# EAGLE design EngineeringModelBoard(6:2015) (EAGLE 7.3.0)

## Sheet 1 of 7: µC and Programming
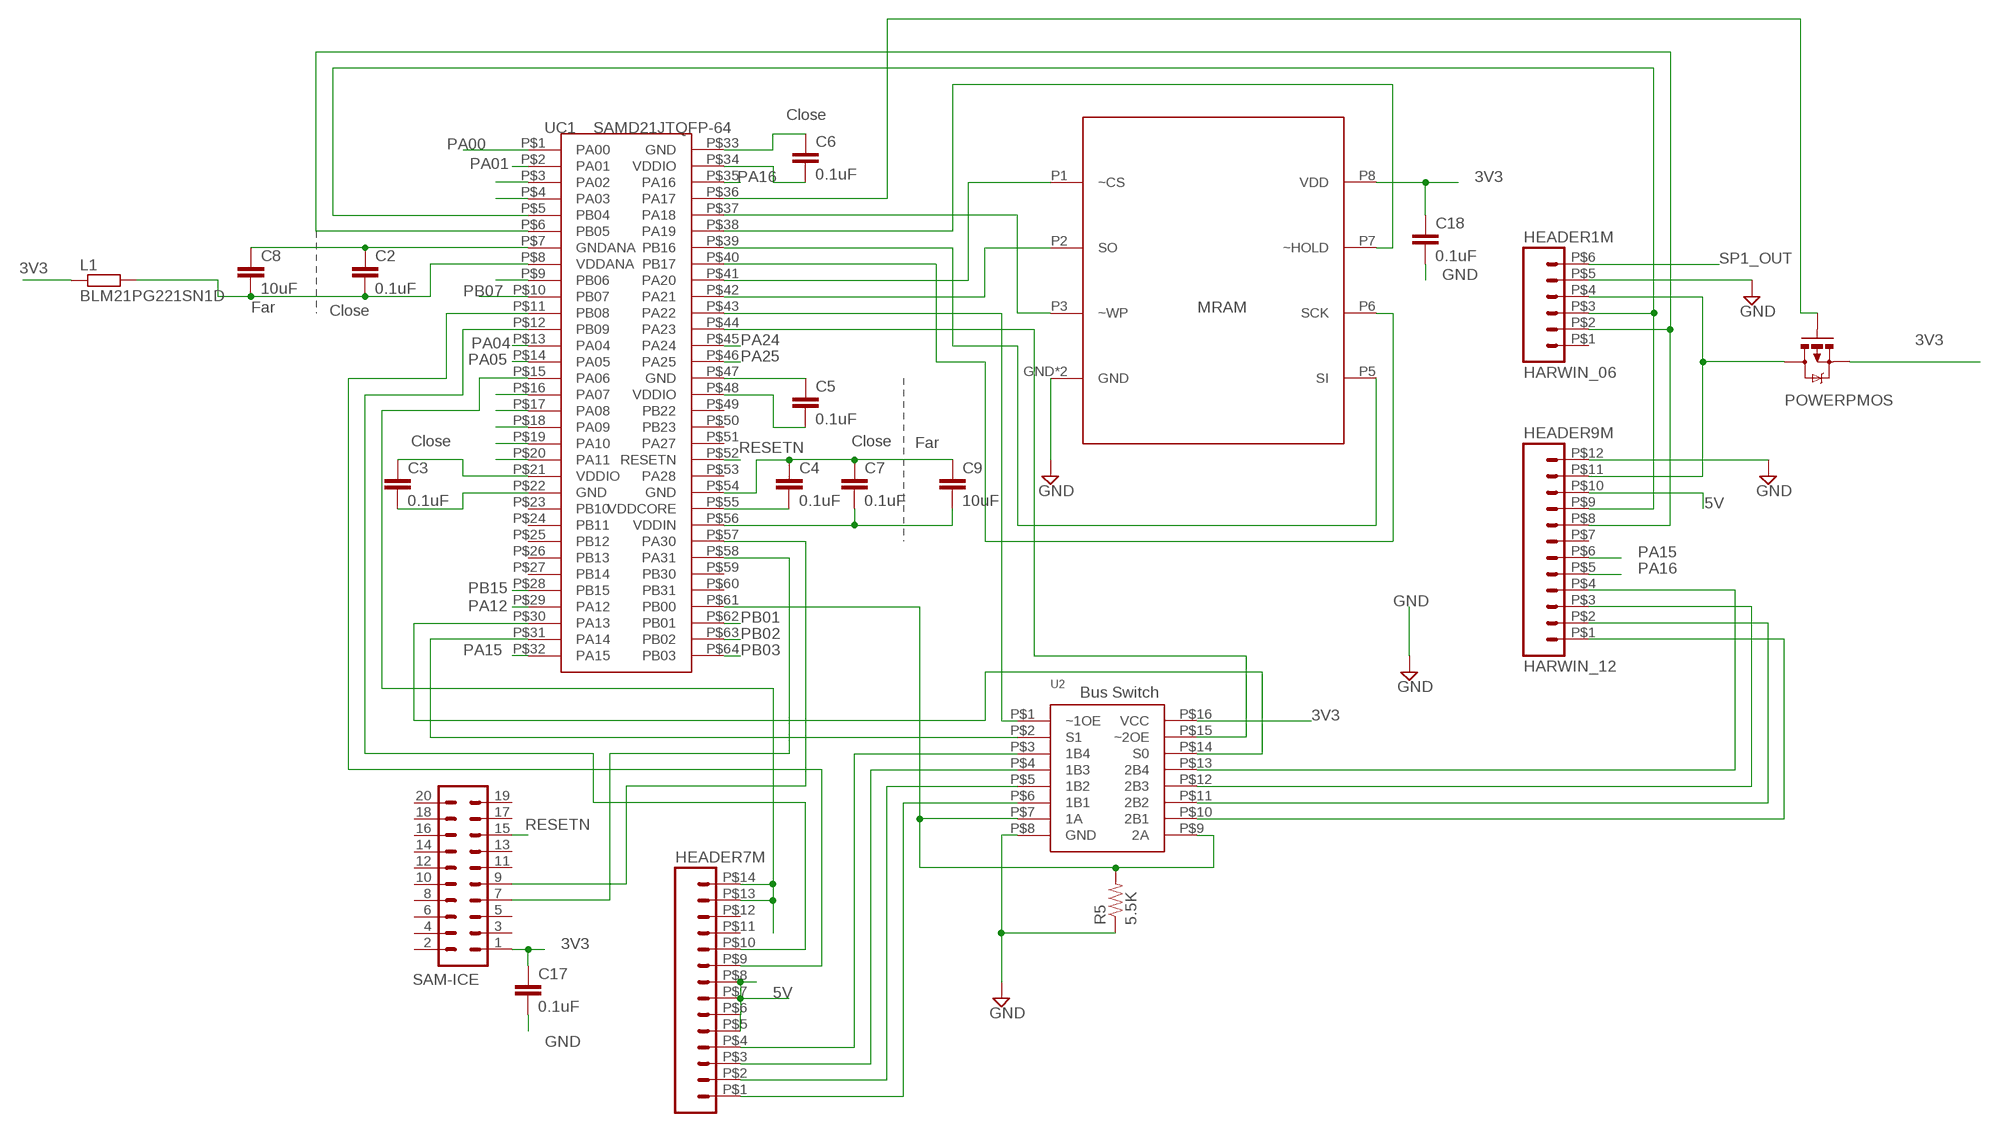
[diagram p0: schematic, sheet 1]

### Parts
C2  0.1uF  CAP0805  [0805]
C3  0.1uF  CAP0805  [0805]
C4  0.1uF  CAP0805  [0805]
C5  0.1uF  CAP0805  [0805]
C6  0.1uF  CAP0805  [0805]
C7  0.1uF  CAP0805  [0805]
C8  10uF  CAP0805  [0805]
C9  10uF  CAP0805  [0805]
C17  0.1uF  CAP0805  [0805]
C18  0.1uF  CAP0805  [0805]
HEADER1M  HARWIN_06  [HARWIN_DATAMATE_6]
HEADER7M  HARWIN_14  [HARWIN_DATAMATE_14]
HEADER9M  HARWIN_12  [HARWIN_DATAMATE_12]
L1  BLM21PG221SN1D  R-EU_R0805  [R0805]
R5  5.5K  RESISTOR  [0805]
SAM-ICE  IDC_JTAG_CONNECTOR  [2X10]
U2  SN74CBTLV3253  [SOIC16R]
U$3  MRAM  MR25H10CDC  [8PXMO-229]
U$14  POWERPMOS  [SO08]
UC1  SAMD21JTQFP-64  [TQFP-64]

### Nets
3V3 [3V3]: C3.1 C5.2 C6.2 C7.2 C9.2 C17.1 C18.1 L1.1 SAM-ICE.1 U2.P$16(VCC) U$3.P8(VDD) U$14.1(S) U$14.2(S) U$14.3(S) UC1.P$21(VDDIO) UC1.P$34(VDDIO) UC1.P$48(VDDIO) UC1.P$56(VDDIN) ; also sheet 4,5
3V3D [3V3]: HEADER1M.P$4 HEADER9M.P$11 U$14.5(D) U$14.6(D) U$14.7(D) U$14.8(D)
5V [5V]: HEADER7M.P$5 HEADER7M.P$6 HEADER7M.P$7 HEADER7M.P$8 HEADER9M.P$10 ; also sheet 4
GND [GND]: C2.1 C4.1 C5.1 C6.1 C7.1 C8.1 C9.1 C17.2 C18.2 HEADER1M.P$5 HEADER9M.P$12 R5.1 U2.P$8(GND) U$3.GND U$3.P4(GND) UC1.P$7(GNDANA) UC1.P$33(GND) UC1.P$47(GND) UC1.P$54(GND) ; also sheet 4,5,6
N$16: U$3.P1(~CS) UC1.P$41(PA20)
N$18: U$3.P2(SO) UC1.P$42(PA21)
N$19: U$3.P3(~WP) UC1.P$37(PA18)
N$20: HEADER9M.P$1 U2.P$10(2B1)
N$21: HEADER9M.P$2 U2.P$11(2B2)
N$22: HEADER9M.P$3 U2.P$12(2B3)
N$23: HEADER9M.P$4 U2.P$13(2B4)
N$24: HEADER7M.P$1 U2.P$6(1B1)
N$25: HEADER7M.P$2 U2.P$5(1B2)
N$26: HEADER7M.P$3 U2.P$4(1B3)
N$27: HEADER7M.P$4 U2.P$3(1B4)
N$28: U2.P$14(S0) UC1.P$30(PA13)
N$29: U2.P$2(S1) UC1.P$31(PA14)
N$30: U2.P$1(~1OE) UC1.P$43(PA22)
N$31: U2.P$15(~2OE) UC1.P$44(PA23)
N$34: U$3.P7(~HOLD) UC1.P$38(PA19)
N$35: U$3.P6(SCK) UC1.P$40(PB17)
N$38: SAM-ICE.7 UC1.P$58(PA31)
N$39: SAM-ICE.9 UC1.P$57(PA30)
N$41: C3.2 UC1.P$22(GND)
N$42: U$3.P5(SI) UC1.P$39(PB16)
N$43: C2.2 C8.2 L1.2 UC1.P$8(VDDANA)
N$47: C4.2 UC1.P$55(VDDCORE)
N$72: U$14.4(G) UC1.P$36(PA17)
PA00: UC1.P$1(PA00) ; also sheet 5
PA01: UC1.P$2(PA01) ; also sheet 5
PA02: UC1.P$3(PA02)
PA03: UC1.P$4(PA03)
PA04: UC1.P$13(PA04) ; also sheet 5
PA05: UC1.P$14(PA05) ; also sheet 5
PA06: HEADER7M.P$13 HEADER7M.P$14 UC1.P$15(PA06)
PA07: UC1.P$16(PA07)
PA08: UC1.P$17(PA08)
PA09: UC1.P$18(PA09)
PA10: UC1.P$19(PA10)
PA11: UC1.P$20(PA11)
PA12: UC1.P$29(PA12) ; also sheet 5
PA15: HEADER9M.P$6 UC1.P$32(PA15)
PA16: HEADER9M.P$5 UC1.P$35(PA16)
PA24: UC1.P$45(PA24) ; also sheet 6
PA25: UC1.P$46(PA25) ; also sheet 6
PB00: R5.2 U2.P$7(1A) U2.P$9(2A) UC1.P$61(PB00)
PB01: UC1.P$62(PB01) ; also sheet 6
PB02: UC1.P$63(PB02) ; also sheet 6
PB03: UC1.P$64(PB03) ; also sheet 6
PB04: HEADER1M.P$3 HEADER9M.P$9 UC1.P$5(PB04)
PB05: HEADER1M.P$2 HEADER9M.P$8 UC1.P$6(PB05)
PB06: UC1.P$9(PB06)
PB07: UC1.P$10(PB07) ; also sheet 4
PB08: HEADER7M.P$9 UC1.P$11(PB08)
PB09: HEADER7M.P$10 UC1.P$12(PB09)
PB15: UC1.P$28(PB15) ; also sheet 5
RESETN: SAM-ICE.15 UC1.P$52(RESETN)
SP1_OUT: HEADER1M.P$6
Unconnected: HEADER1M.P$1 HEADER7M.P$11 HEADER7M.P$12 HEADER9M.P$7 SAM-ICE.2 SAM-ICE.3 SAM-ICE.4 SAM-ICE.5 SAM-ICE.6 SAM-ICE.8 SAM-ICE.10 SAM-ICE.11 SAM-ICE.12 SAM-ICE.13 SAM-ICE.14 SAM-ICE.16 SAM-ICE.17 SAM-ICE.18 SAM-ICE.19 SAM-ICE.20 UC1.P$23(PB10) UC1.P$24(PB11) UC1.P$25(PB12) UC1.P$26(PB13) UC1.P$27(PB14) UC1.P$49(PB22) UC1.P$50(PB23) UC1.P$51(PA27) UC1.P$53(PA28) UC1.P$59(PB30) UC1.P$60(PB31)

### Notes on the sheet
- Close
- Far | Close | MRAM
- Close | Close | Far
- Bus Switch

## Sheet 2 of 7: Flash Panel
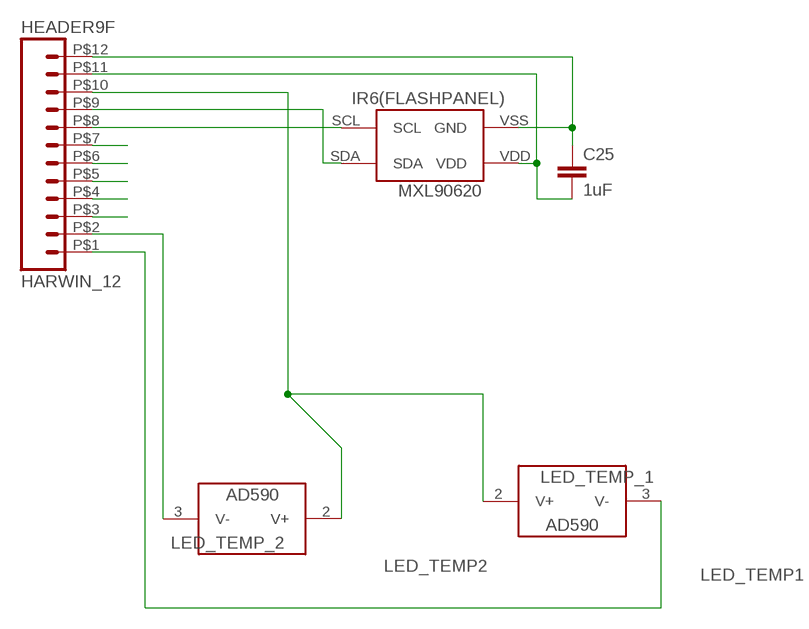
[diagram p1: schematic, sheet 2]

### Parts
C25  1uF  CAP0805  [0805]
HEADER9F  HARWIN_12  [HARWIN_DATAMATE_12]
IR6(FLASHPANEL)  MXL90620  [MXL90620]
LED_TEMP_1  AD590-SOIC-8  [8SOIC]
LED_TEMP_2  AD590-SOIC-8  [8SOIC]

### Nets
H9.1: HEADER9F.P$1 LED_TEMP_1.3(V-)
H9.2: HEADER9F.P$2 LED_TEMP_2.3(V-)
H9.3: HEADER9F.P$3
H9.4: HEADER9F.P$4
H9.5: HEADER9F.P$5
H9.6: HEADER9F.P$6
H9.7: HEADER9F.P$7
H9.8: HEADER9F.P$8 IR6(FLASHPANEL).SCL
H9.9: HEADER9F.P$9 IR6(FLASHPANEL).SDA
H9.10: HEADER9F.P$10 LED_TEMP_1.2(V+) LED_TEMP_2.2(V+)
H9.11: C25.2 HEADER9F.P$11 IR6(FLASHPANEL).VDD
H9.12: C25.1 HEADER9F.P$12 IR6(FLASHPANEL).VSS(GND)

### Notes on the sheet
- LED_TEMP2
- LED_TEMP1

## Sheet 3 of 7: Side 1
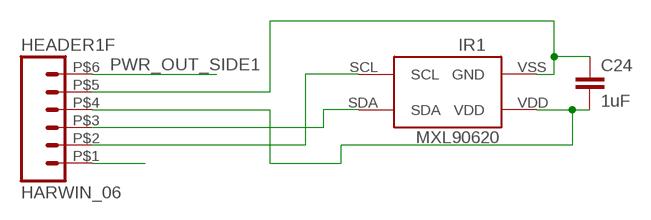
[diagram p2: schematic, sheet 3]

### Parts
C24  1uF  CAP0805  [0805]
HEADER1F  HARWIN_06  [HARWIN_DATAMATE_6]
IR1  MXL90620  [MXL90620]

### Nets
H1.1: HEADER1F.P$1
H1.2: HEADER1F.P$2 IR1.SCL
H1.3: HEADER1F.P$3 IR1.SDA
H1.4: C24.2 HEADER1F.P$4 IR1.VDD
H1.5: C24.1 HEADER1F.P$5 IR1.VSS(GND)
PWR_OUT_SIDE1: HEADER1F.P$6

## Sheet 4 of 7: Power Regulation
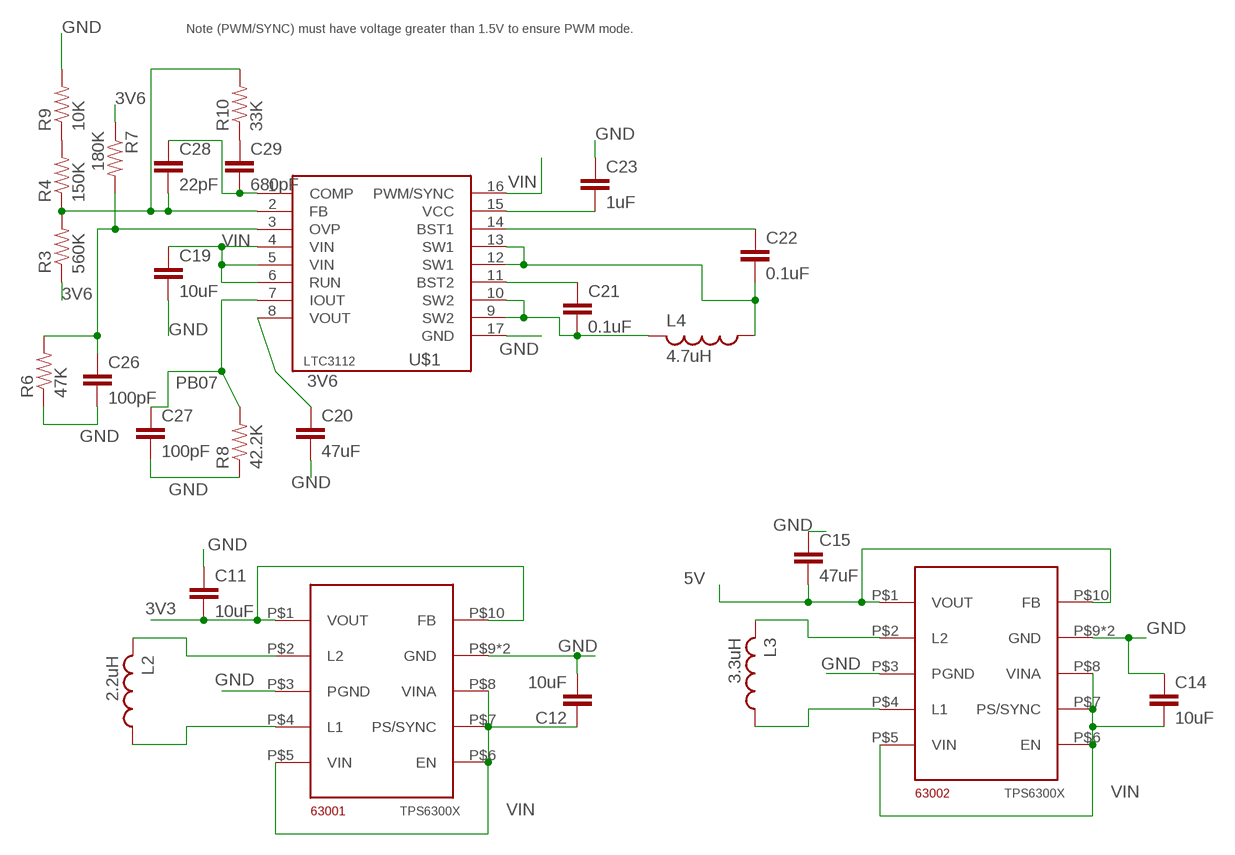
[diagram p3: schematic, sheet 4]

### Parts
63001  TPS6300X  [QFN10_POWERPAD]
63002  TPS6300X  [QFN10_POWERPAD]
C11  10uF  CAP0603-CAP  [0603-CAP]
C12  10uF  CAP0603-CAP  [0603-CAP]
C14  10uF  CAP0603-CAP  [0603-CAP]
C15  47uF  CAP0603-CAP  [0603-CAP]
C19  10uF  CAP0603-CAP  [0603-CAP]
C20  47uF  CAP0805  [0805]
C21  0.1uF  CAP0603-CAP  [0603-CAP]
C22  0.1uF  CAP0603-CAP  [0603-CAP]
C23  1uF  CAP0603-CAP  [0603-CAP]
C26  100pF  CAP0805  [0805]
C27  100pF  CAP0805  [0805]
C28  22pF  CAP0805  [0805]
C29  680pF  CAP0805  [0805]
L2  2.2uH  L-USL3225M  [L3225M]
L3  3.3uH  L-USL3225M  [L3225M]
L4  4.7uH  L-USL3225M  [L3225M]
R3  560K  RESISTOR  [0805]
R4  150K  RESISTOR  [0805]
R6  47K  RESISTOR  [0805]
R7  180K  RESISTOR  [0805]
R8  42.2K  RESISTOR  [0805]
R9  10K  RESISTOR  [0805]
R10  33K  RESISTOR  [0805]
U$1  LTC3112  [DHD16]

### Nets
3V3 [3V3]: 63001.P$1(VOUT) 63001.P$10(FB) C11.2 ; also sheet 1,5
3V6 [3V6]: C20.1 R3.1 R7.1 U$1.8(VOUT) ; also sheet 6
5V [5V]: 63002.P$1(VOUT) 63002.P$10(FB) C15.2 ; also sheet 1
GND [GND]: 63001.P$3(PGND) 63001.P$9(GND) 63001.PAD(GND) 63002.P$3(PGND) 63002.P$9(GND) 63002.PAD(GND) C11.1 C12.2 C14.1 C15.1 C19.2 C20.2 C23.1 C26.2 C27.2 R6.1 R8.1 R9.2 U$1.17(GND) ; also sheet 1,5,6
N$3: C21.1 U$1.11(BST2)
N$4: C22.1 U$1.14(BST1)
N$5: C23.2 U$1.15(VCC)
N$40: C22.2 L4.1 U$1.12(SW1) U$1.13(SW1)
N$45: 63002.P$2(L2) L3.2
N$46: 63002.P$4(L1) L3.1
N$48: 63001.P$2(L2) L2.2
N$50: 63001.P$4(L1) L2.1
N$53: C21.2 L4.2 U$1.9(SW2) U$1.10(SW2)
N$54: C28.2 R3.2 R4.1 R10.2 U$1.2(FB)
N$69: C26.1 R6.2 R7.2 U$1.3(OVP)
N$70: C29.1 R10.1
N$71: C28.1 C29.2 U$1.1(COMP)
N$999: R4.2 R9.1
PB07: C27.1 R8.2 U$1.7(IOUT) ; also sheet 1
VIN: 63001.P$5(VIN) 63001.P$6(EN) 63001.P$7(PS/SYNC) 63001.P$8(VINA) 63002.P$5(VIN) 63002.P$6(EN) 63002.P$7(PS/SYNC) 63002.P$8(VINA) C12.1 C14.2 C19.1 U$1.4(VIN) U$1.5(VIN) U$1.6(RUN) U$1.16(PWM/SYNC) ; also sheet 5

### Notes on the sheet
- Note (PWM/SYNC) must have voltage greater than 1.5V to ensure PWM mode.

## Sheet 5 of 7: Sensors
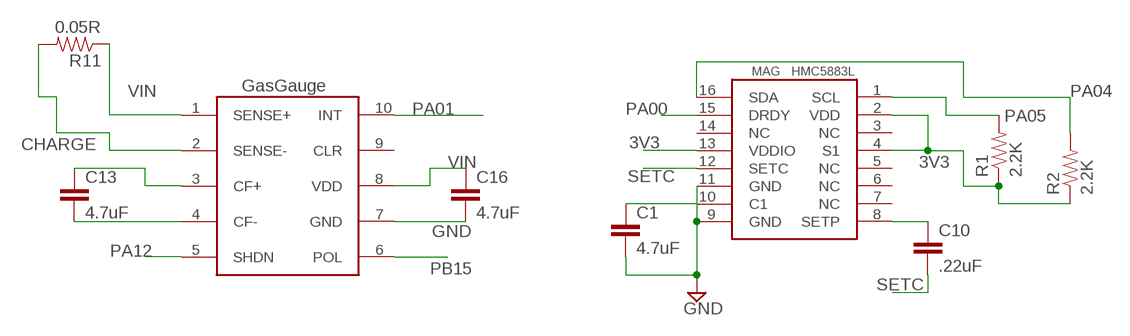
[diagram p4: schematic, sheet 5]

### Parts
C1  4.7uF  CAP0805  [0805]
C10  .22uF  CAP0805  [0805]
C13  4.7uF  CAP0805  [0805]
C16  4.7uF  CAP0805  [0805]
MAG  HMC5883L  [HMC5883L]
R1  2.2K  RESISTOR  [0805]
R2  2.2K  RESISTOR  [0805]
R11  0.05R  RESISTOR  [0805]
U$2  LTC4150  [MSOP10]

### Nets
3V3 [3V3]: MAG.2(VDD) MAG.4(S1) MAG.13(VDDIO) R1.1 R2.1 ; also sheet 1,4
CHARGE: R11.2 U$2.2(SENSE-)
GND [GND]: C1.2 C16.2 MAG.9(GND) MAG.11(GND) U$2.7(GND) ; also sheet 1,4,6
N$1: C1.1 MAG.10(C1)
N$36: C10.1 MAG.8(SETP)
N$57: C13.1 U$2.3(CF+)
N$58: C13.2 U$2.4(CF-)
PA00: MAG.15(DRDY) ; also sheet 1
PA01: U$2.10(INT) ; also sheet 1
PA04: MAG.16(SDA) R2.2 ; also sheet 1
PA05: MAG.1(SCL) R1.2 ; also sheet 1
PA12: U$2.5(SHDN) ; also sheet 1
PB15: U$2.6(POL) ; also sheet 1
SETC: C10.2 MAG.12(SETC)
VIN: C16.1 R11.1 U$2.1(SENSE+) U$2.8(VDD) ; also sheet 4
Unconnected: MAG.3(NC) MAG.5(NC) MAG.6(NC) MAG.7(NC) MAG.14(NC) U$2.9(CLR)

### Notes on the sheet
- GasGauge

## Sheet 6 of 7: Radio
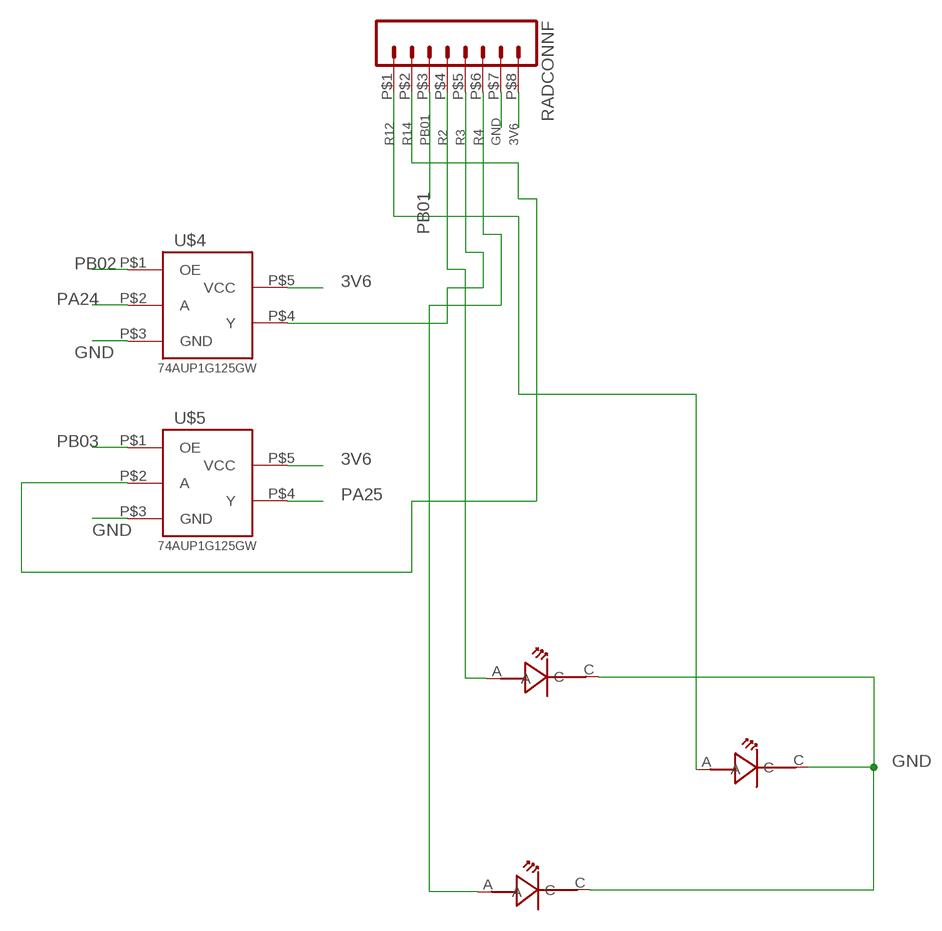
[diagram p5: schematic, sheet 6]

### Parts
RADCONNF  HARWIN_08  [HARWIN_DATAMATE_08]
U$4  74AUP1G125GW  [TSSOP-5]
U$5  74AUP1G125GW  [TSSOP-5]
U$11  LT-T673-Q1R2-25-Z  [PLCC-2]
U$12  LT-T673-Q1R2-25-Z  [PLCC-2]
U$13  LT-T673-Q1R2-25-Z  [PLCC-2]

### Nets
3V6 [3V6]: RADCONNF.P$8 U$4.P$5(VCC) U$5.P$5(VCC) ; also sheet 4
GND [GND]: RADCONNF.P$7 U$4.P$3(GND) U$5.P$3(GND) U$11.C U$12.C U$13.C ; also sheet 1,4,5
PA24: U$4.P$2(A) ; also sheet 1
PA25: U$5.P$4(Y) ; also sheet 1
PB01: RADCONNF.P$3 ; also sheet 1
PB02: U$4.P$1(OE) ; also sheet 1
PB03: U$5.P$1(OE) ; also sheet 1
R2: RADCONNF.P$4 U$13.A
R3: RADCONNF.P$5 U$4.P$4(Y)
R4: RADCONNF.P$6 U$12.A
R12: RADCONNF.P$1 U$11.A
R14: RADCONNF.P$2 U$5.P$2(A)

## Sheet 7 of 7: Batteries
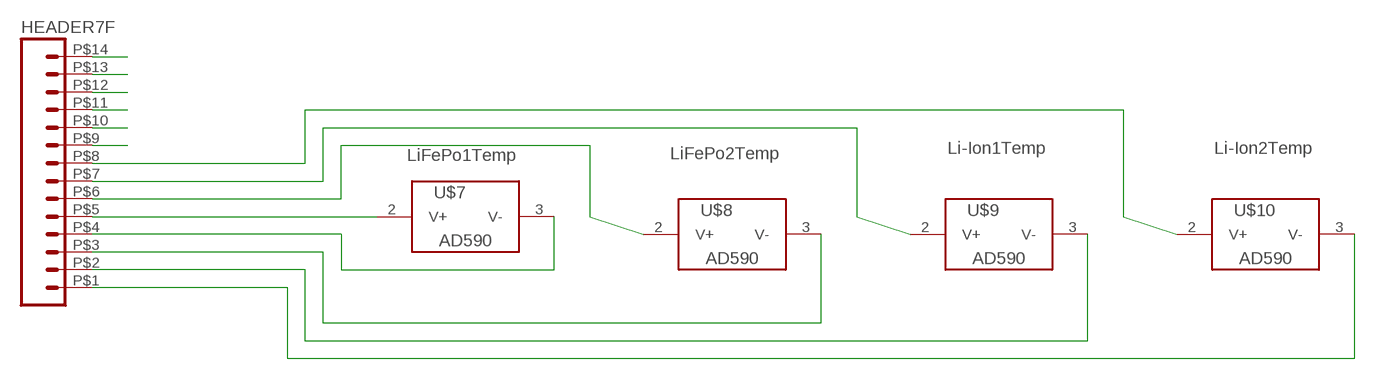
[diagram p6: schematic, sheet 7]

### Parts
HEADER7F  HARWIN_14  [HARWIN_DATAMATE_14]
U$7  AD590-SOIC-8  [8SOIC]
U$8  AD590-SOIC-8  [8SOIC]
U$9  AD590-SOIC-8  [8SOIC]
U$10  AD590-SOIC-8  [8SOIC]

### Nets
H7.1: HEADER7F.P$1 U$10.3(V-)
H7.2: HEADER7F.P$2 U$9.3(V-)
H7.3: HEADER7F.P$3 U$8.3(V-)
H7.4: HEADER7F.P$4 U$7.3(V-)
H7.5: HEADER7F.P$5 U$7.2(V+)
H7.6: HEADER7F.P$6 U$8.2(V+)
H7.7: HEADER7F.P$7 U$9.2(V+)
H7.8: HEADER7F.P$8 U$10.2(V+)
H7.9: HEADER7F.P$9
H7.10: HEADER7F.P$10
H7.11: HEADER7F.P$11
H7.12: HEADER7F.P$12
H7.13: HEADER7F.P$13
H7.14: HEADER7F.P$14

### Notes on the sheet
- Li-Ion1Temp | Li-Ion2Temp
- LiFePo1Temp | LiFePo2Temp

## Library data of the parts
63001 63002 = CNTRL_BOARD:TPS6300X; OC_NEWARK: unknown
C1 C13 C16 = CNTRL_BOARD:CAP: Capacitor Standard 0603 ceramic capacitor, and 0.1" leaded capacitor.; MF: AVX CORPORATION; MPN: 08056D475KAT2A; OC_NEWARK: 84K8400
C2-C7 C17 C18 C21 C22 = CNTRL_BOARD:CAP: Capacitor Standard 0603 ceramic capacitor, and 0.1" leaded capacitor.; MPN: 0603YC104JAT2A; OC_NEWARK: 96M1175
C8 C9 = CNTRL_BOARD:CAP: Capacitor Standard 0603 ceramic capacitor, and 0.1" leaded capacitor.; MF: AVX CORPORATION; MPN: 08056D106KAT2A; OC_NEWARK: 84K8398
C10 = CNTRL_BOARD:CAP: Capacitor Standard 0603 ceramic capacitor, and 0.1" leaded capacitor.; MF: AVX CORPORATION; MPN: 08053C224KAT2A; OC_NEWARK: 96K4775
C11 C12 C19 C23 = CNTRL_BOARD:CAP: Capacitor Standard 0603 ceramic capacitor, and 0.1" leaded capacitor.; OC_NEWARK: unknown
C14 = CNTRL_BOARD:CAP: Capacitor Standard 0603 ceramic capacitor, and 0.1" leaded capacitor.; MPN: C1608X5R1A225K080AC; OC_NEWARK: 04X3244
C15 C20 = CNTRL_BOARD:CAP: Capacitor Standard 0603 ceramic capacitor, and 0.1" leaded capacitor.; MPN: EMK107B7474KA-T; OC_NEWARK: 77M8434
C24 C25 = CNTRL_BOARD:CAP: Capacitor Standard 0603 ceramic capacitor, and 0.1" leaded capacitor.; MPN: 0805ZC105KAT2A; OC_NEWARK: 96M1308
C26 C27 = CNTRL_BOARD:CAP: Capacitor Standard 0603 ceramic capacitor, and 0.1" leaded capacitor.; MF: AVX CORPORATION; MPN: 08051A101J4T4A; OC_NEWARK: 55J5675
C28 = CNTRL_BOARD:CAP: Capacitor Standard 0603 ceramic capacitor, and 0.1" leaded capacitor.; MF: AVX CORPORATION; MPN: 08051A220JAT2A; OC_NEWARK: 96K4769
C29 = CNTRL_BOARD:CAP: Capacitor Standard 0603 ceramic capacitor, and 0.1" leaded capacitor.; MPN: 08055C681KAT2A; OC_NEWARK: 94W2947
HEADER1F HEADER1M = CNTRL_BOARD:HARWIN_06; OC_NEWARK: unknown
HEADER7F HEADER7M = CNTRL_BOARD:HARWIN_14; OC_NEWARK: unknown
HEADER9F HEADER9M = CNTRL_BOARD:HARWIN_12; OC_NEWARK: unknown
IR1 IR6(FLASHPANEL) = CNTRL_BOARD:MXL90620; OC_NEWARK: unknown
L1 = rcl:R-EU_: RESISTOR, European symbol; MPN: BLM21PG221SN1D; OC_NEWARK: 73M9167
L2 L4 = resistor:L-US: INDUCTOR, American symbol; OC_NEWARK: unknown
L3 = resistor:L-US: INDUCTOR, American symbol; MPN: JMK212BJ335KG-T; OC_NEWARK: 08P5148
LED_TEMP_1 LED_TEMP_2 U$7-U$10 = CNTRL_BOARD:AD590-SOIC-8; MPN: AD590JRZ; OC_NEWARK: 29M8422
MAG = CNTRL_BOARD:HMC5883L; MPN: HMC5883L-TR; OC_NEWARK: 20T0699
R1 R2 = CNTRL_BOARD:RESISTOR; MPN: SR1-0805-222; OC_NEWARK: 33C6600
R3 = CNTRL_BOARD:RESISTOR; MPN: MC01W08051560K; OC_NEWARK: 94W6326
R4-R6 R8-R11 = CNTRL_BOARD:RESISTOR; OC_NEWARK: unknown
R7 = CNTRL_BOARD:RESISTOR; MPN: ERJ-6GEYJ184V; OC_NEWARK: 53W4944
RADCONNF = CNTRL_BOARD:HARWIN_08; OC_NEWARK: unknown
SAM-ICE = CNTRL_BOARD:IDC_JTAG_CONNECTOR; OC_NEWARK: unknown
U2 = CNTRL_BOARD:SN74CBTLV3253; OC_NEWARK: unknown
U$1 = CNTRL_BOARD:LTC3112; MPN: LTC3112EFE#PBF; OC_NEWARK: 24T2752
U$2 = linear-technology:LTC4150; MPN: LTC4150CMS#PBF; OC_NEWARK: 56M8728
U$3 = mram:MR25H10CDC; OC_NEWARK: unknown
U$4 U$5 = CNTRL_BOARD:74AUP1G125GW; MPN: 74AUP1G125GW; OC_NEWARK: 55W4620
U$11-U$13 = CNTRL_BOARD:LT-T673-Q1R2-25-Z; OC_NEWARK: unknown
U$14 = CNTRL_BOARD:POWERPMOS; OC_NEWARK: unknown
UC1 = SAMD21J:SAMD21J; OC_NEWARK: unknown

## Net classes
0 default: width 0.203 mm, drill 0.203 mm, clearance 0.203 mm
1 GND: width 0.508 mm, drill 0.254 mm, clearance 0.305 mm
2 3V3: width 0.508 mm, drill 0.254 mm, clearance 0.305 mm
3 3V6: width 1.016 mm, drill 0.254 mm, clearance 0.305 mm
4 5V: width 0.508 mm, drill 0.254 mm, clearance 0.305 mm

## Board
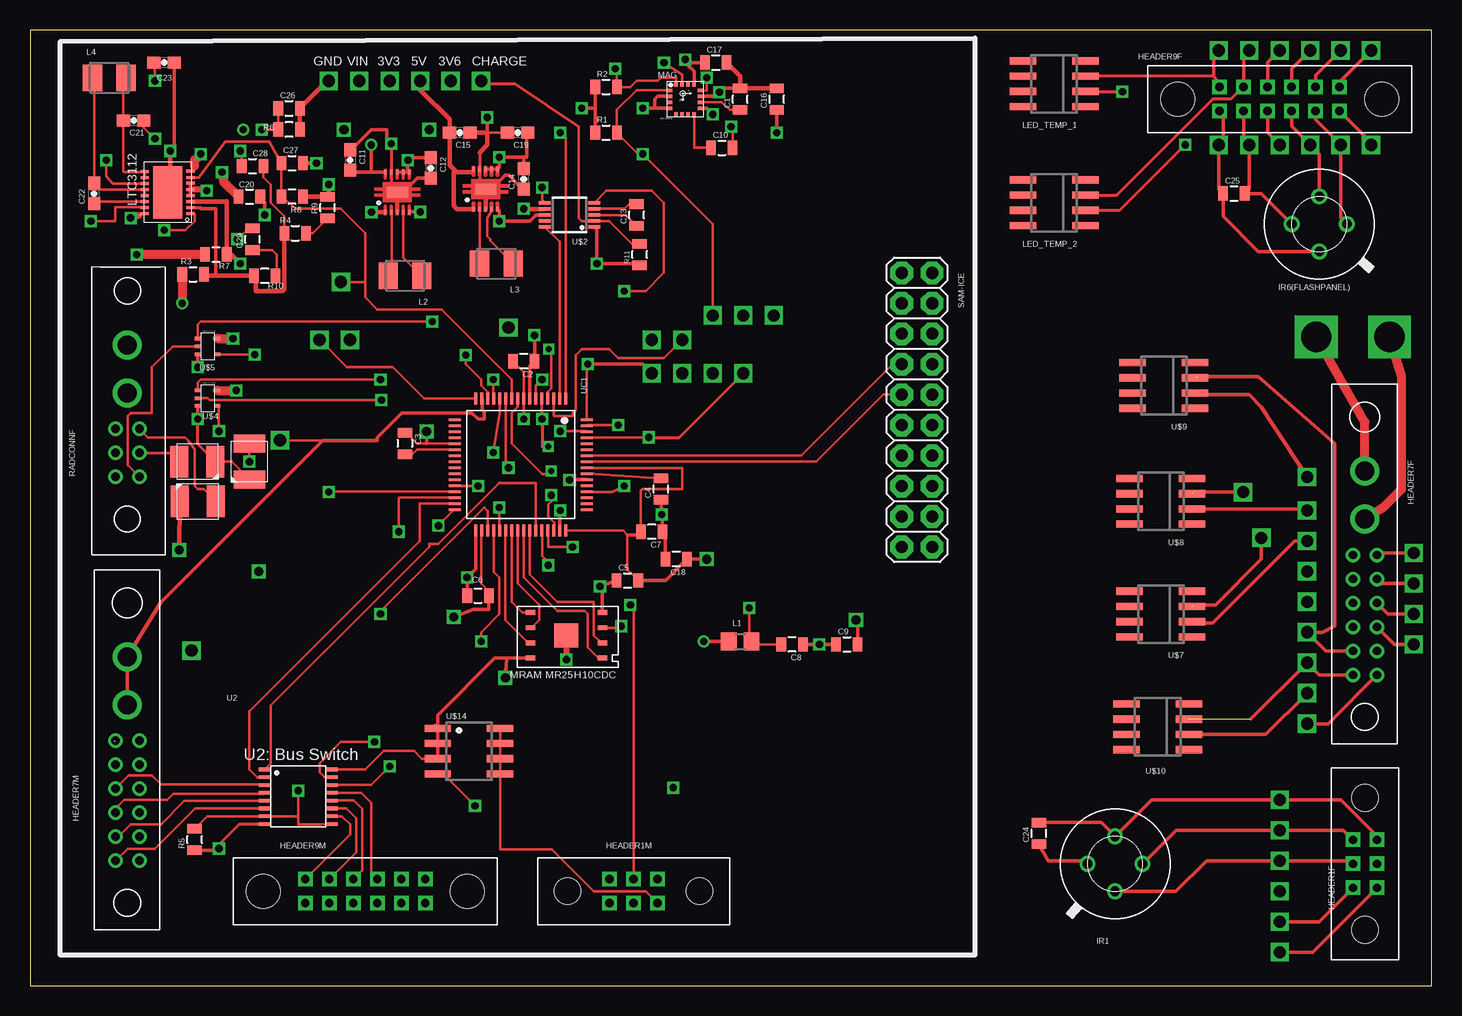
[diagram p7: board, top side]
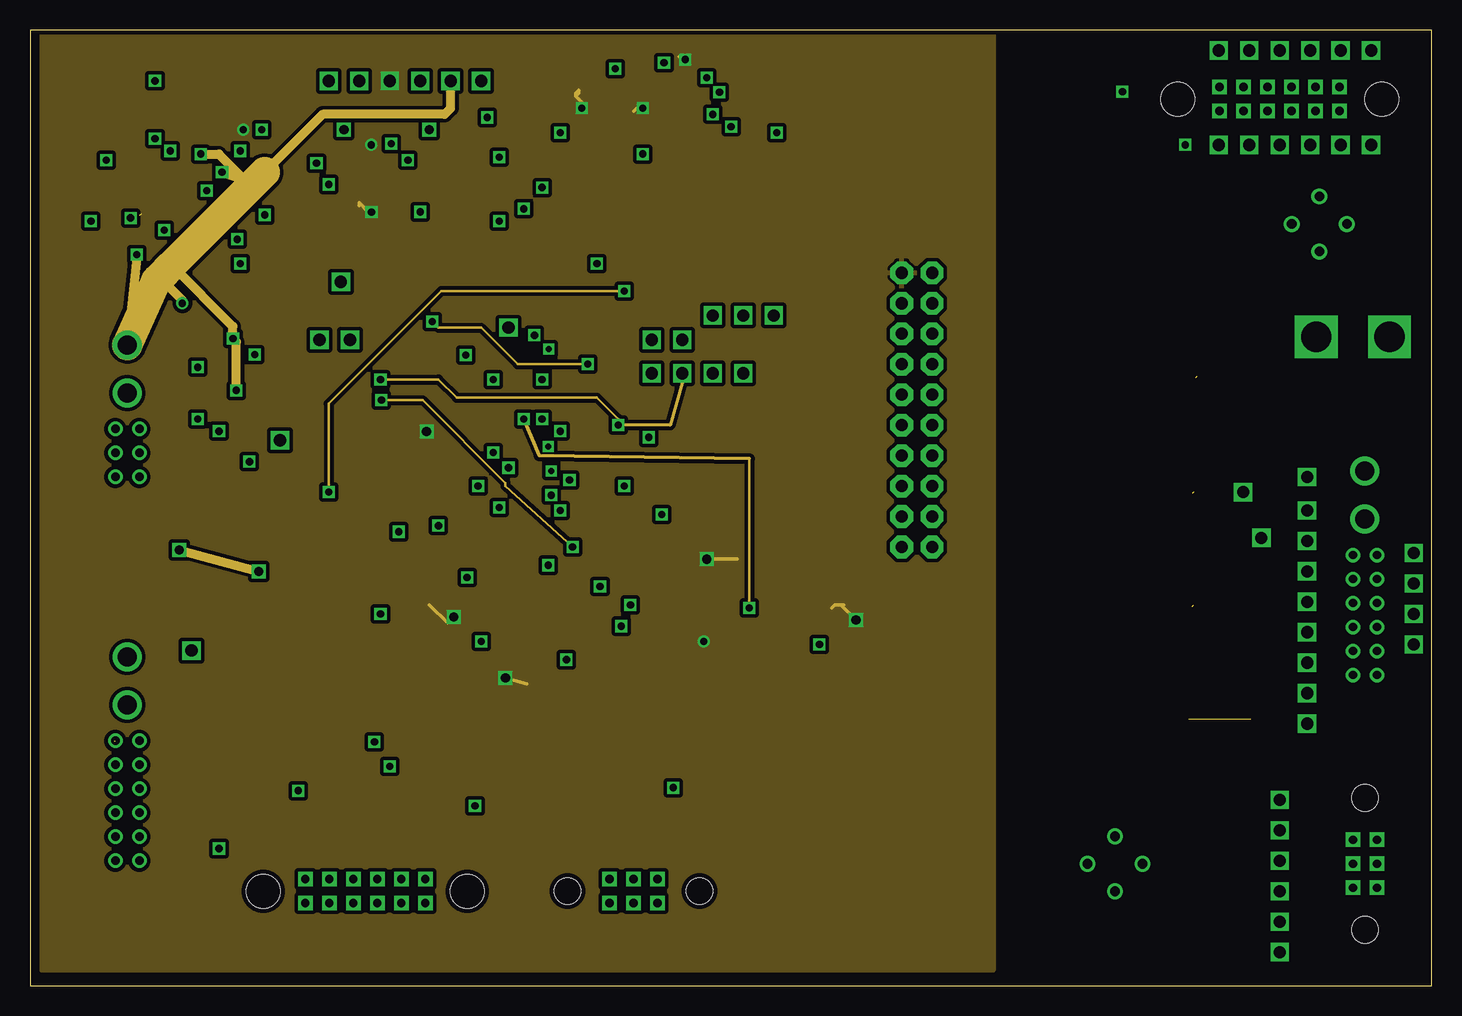
[diagram p8: board, inner layer Route2]
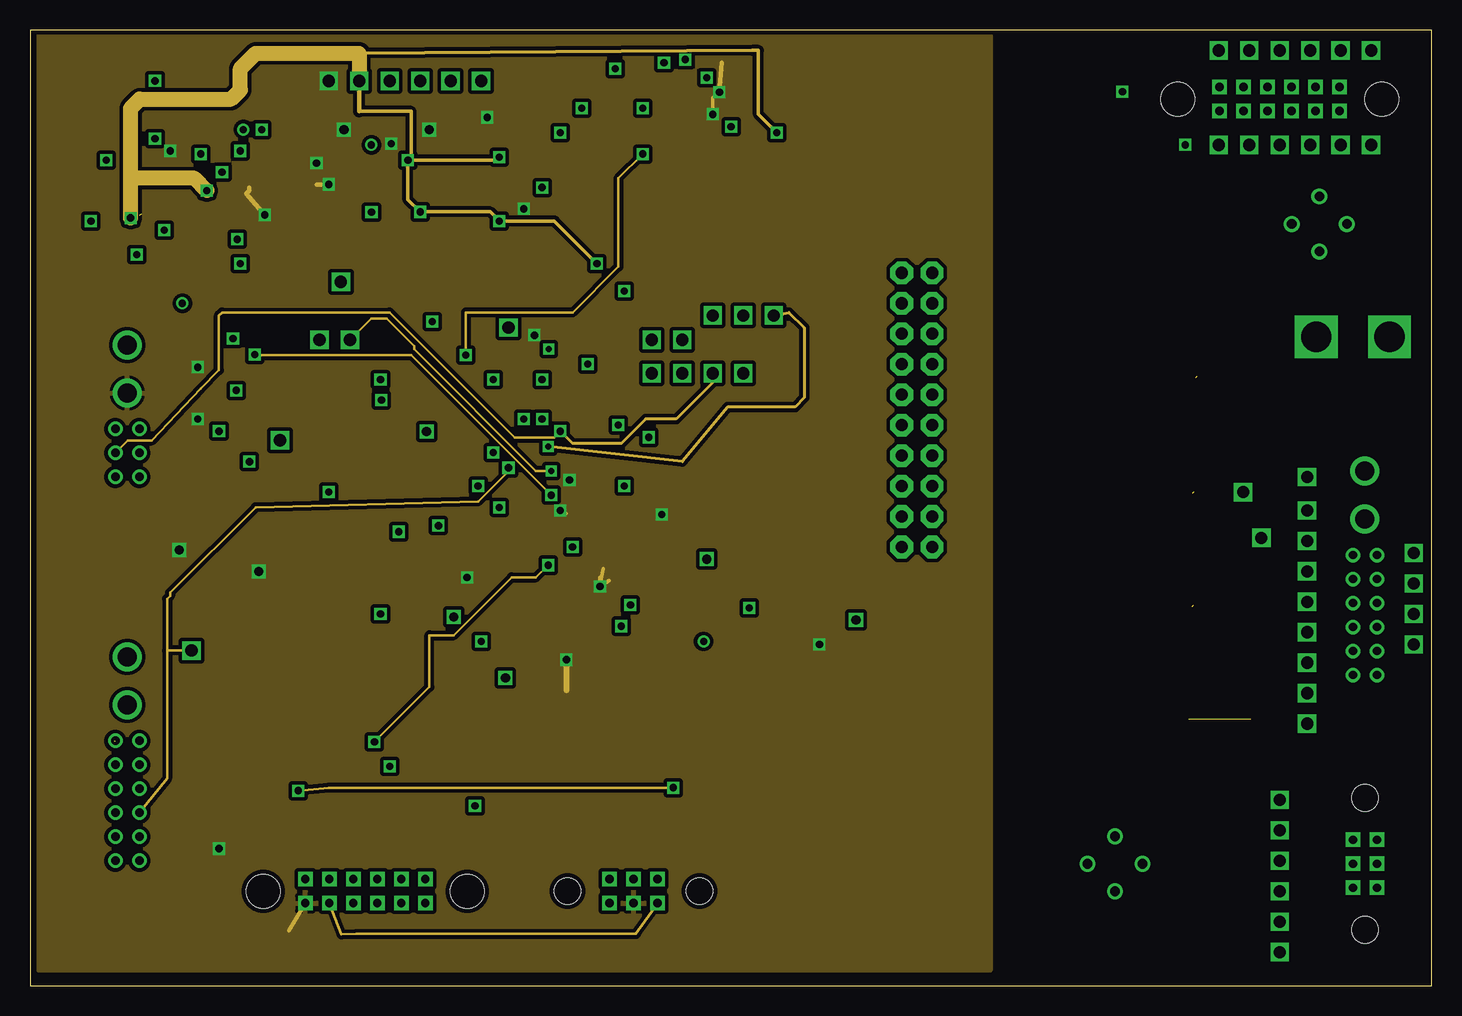
[diagram p9: board, inner layer Route3]
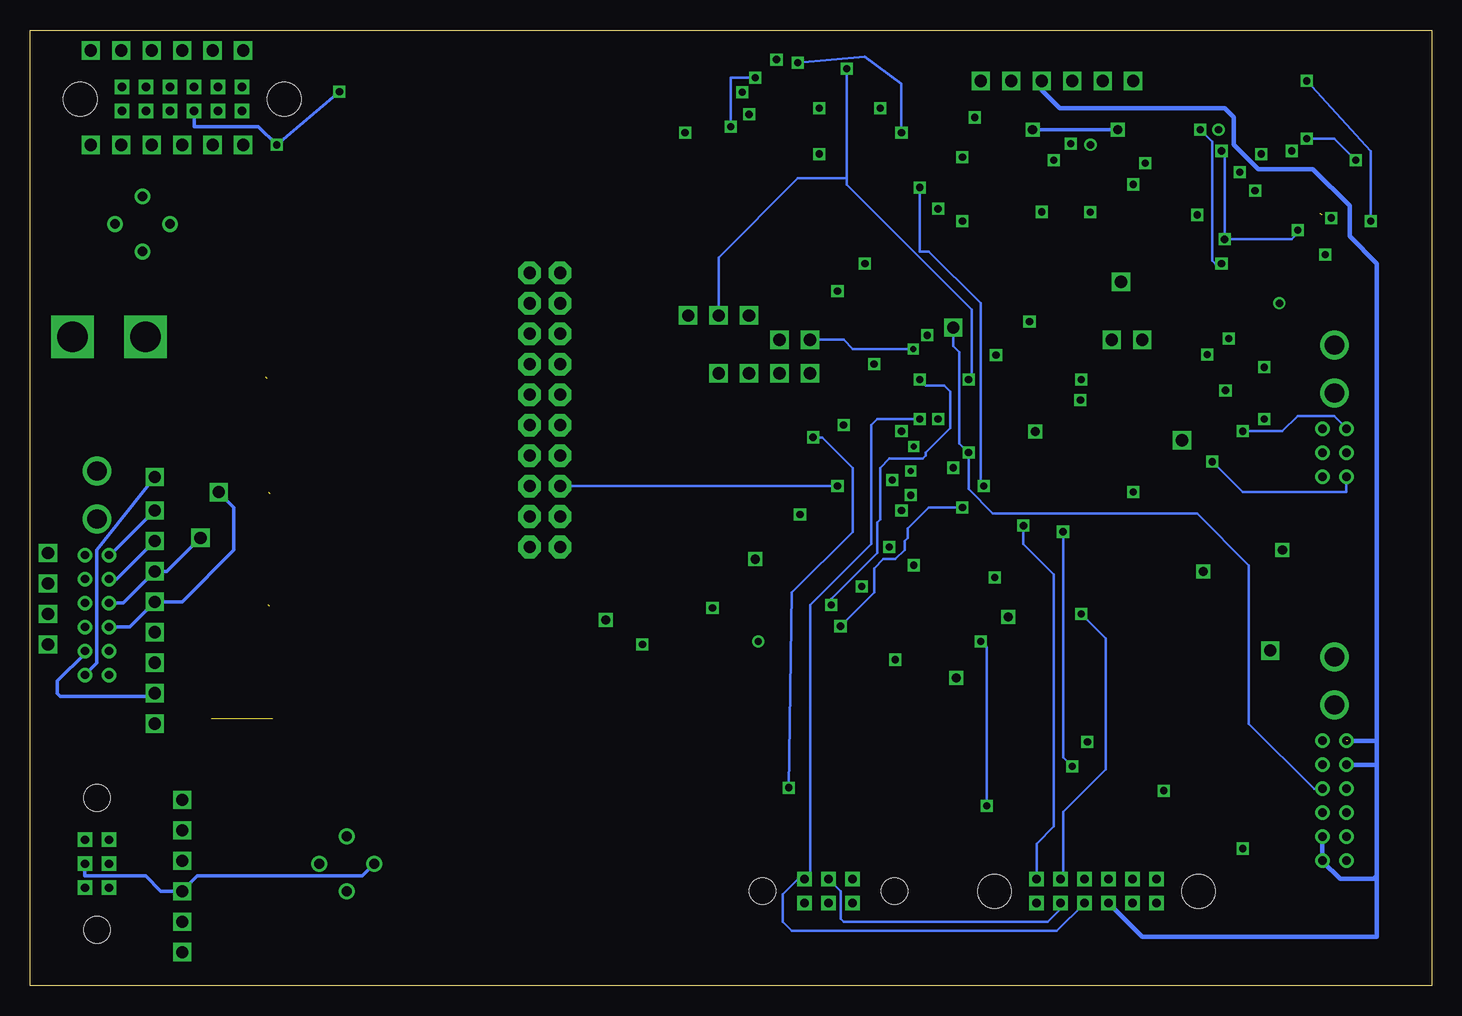
[diagram p10: board, bottom side, seen from below]

Size 116.82 x 79.68 mm. Coordinates in mm from the lower left corner, seen from the top.
Outline: 0,0 116.82,0 116.82,79.68 0,79.68 0,0
Copper layers (1*2*3*16): Top 0.035mm / dielectric 0.5mm / Route2 0.035mm / dielectric 0.5mm / Route3 0.035mm / dielectric 0.5mm / Bottom 0.035mm
Design rules "typical_4pcb *": minimum track width 8mil, minimum drill 10mil, track to track 8mil, track to pad 8mil, pad to pad 8mil, via to via 8mil, smd to smd 8mil, copper to edge 15mil, drill to drill 8mil, minimum pad ring 10mil, minimum via ring 8mil, stop-mask expansion 4mil, vias tented up to drill 0mil, thermal gap 10mil

### Footprints (pad centres in the part's own frame; a part is rotated, then mirrored left to right if it is on the bottom)
QFN10_POWERPAD = smd 0.203 x 0.406: P$1 0.14,0.241; P$2 0.641,0.241; P$3 1.141,0.242; P$4 1.639,0.239; P$5 2.139,0.242; P$6 2.14,3.559; P$7 1.639,3.559; P$8 1.139,3.555; P$9 0.641,3.555; P$10 0.139,3.558 | smd 1.778 x 0.914: PAD 1.155,1.898
0805 = smd 0.8 x 1.2: 1 -0.9,0; 2 0.9,0
0603-CAP = smd 1.1 x 1: 1 -0.85,0; 2 0.85,0
HARWIN_DATAMATE_6 = drill 0.7 square: P$1 -2,1; P$2 0,1; P$3 2,1; P$4 2,-1; P$5 0,-1; P$6 -2,-1 | hole 2.2: -5.5,0; 5.5,0
HARWIN_DATAMATE_14 = drill 0.7: P$1 0,0; P$2 2,0; P$3 4,0; P$4 6,0; P$5 8,0; P$6 10,0; P$7 0,-2; P$8 2,-2; P$9 4,-2; P$10 6,-2; P$11 8,-2; P$12 10,-2 | drill 1.6: P$13 13,-1; P$14 17,-1
HARWIN_DATAMATE_12 = drill 0.7 square: P$1 -5,1; P$2 -3,1; P$3 -1,1; P$4 1,1; P$5 3,1; P$6 5,1; P$7 5,-1; P$8 3,-1; P$9 1,-1; P$10 -1,-1; P$11 -3,-1; P$12 -5,-1 | hole 2.8: -8.5,0; 8.5,0
MXL90620 = drill 0.8: SCL 2.293,0; VDD -2.293,0; VSS 0,-2.294 | drill 0.8 pad 1.2: SDA 0,2.294
R0805 = smd 1.3 x 1.5: 1 -0.95,0; 2 0.95,0
L3225M = smd 1.6 x 2.2: 1 -1.4,0; 2 1.4,0
8SOIC = smd 0.6 x 2.2: 1 -1.905,-2.6; 2 -0.635,-2.6; 3 0.635,-2.6; 4 1.905,-2.6; 5 1.905,2.6; 6 0.635,2.6; 7 -0.635,2.6; 8 -1.905,2.6
HMC5883L = smd 0.45 x 0.3: 1 0.225,2.25; 2 0.225,1.75; 3 0.225,1.25; 4 0.225,0.75; 9 2.775,0.75; 10 2.775,1.25; 11 2.775,1.75; 12 2.775,2.25 | smd 0.3 x 0.45: 5 0.75,0.225; 6 1.25,0.225; 7 1.75,0.225; 8 2.25,0.225; 13 2.25,2.775; 14 1.75,2.775; 15 1.25,2.775; 16 0.75,2.775
HARWIN_DATAMATE_08 = drill 0.7: P$1 0,0; P$2 0,-2; P$3 2,0; P$4 2,-2; P$5 4,0; P$6 4,-2 | drill 1.6: P$7 7,-1; P$8 11,-1
2X10 = drill 1.016 pad 1.88 octagon: 1 -11.43,-1.27; 2 -11.43,1.27; 3 -8.89,-1.27; 4 -8.89,1.27; 5 -6.35,-1.27; 6 -6.35,1.27; 7 -3.81,-1.27; 8 -3.81,1.27; 9 -1.27,-1.27; 10 -1.27,1.27; 11 1.27,-1.27; 12 1.27,1.27; 13 3.81,-1.27; 14 3.81,1.27; 15 6.35,-1.27; 16 6.35,1.27; 17 8.89,-1.27; 18 8.89,1.27; 19 11.43,-1.27; 20 11.43,1.27
SOIC16R = smd 0.3 x 1: P$1 0,0; P$2 0.65,0; P$3 1.3,0; P$4 1.95,0; P$5 2.6,0; P$6 3.25,0; P$7 3.9,0; P$8 4.55,0; P$9 4.55,5.6; P$10 3.9,5.6; P$11 3.25,5.6; P$12 2.6,5.6; P$13 1.95,5.6; P$14 1.3,5.6; P$15 0.65,5.6; P$16 0,5.6
DHD16 = smd 0.25 x 0.7: 1 0.125,0.35; 2 0.625,0.35; 3 1.125,0.35; 4 1.625,0.35; 5 2.125,0.35; 6 2.638,0.35; 7 3.125,0.35; 8 3.638,0.35; 9 3.625,4.15; 10 3.125,4.15; 11 2.625,4.15; 12 2.125,4.15; 13 1.625,4.15; 14 1.125,4.15; 15 0.625,4.15; 16 0.125,4.15 | smd 4.34 x 2.44: 17 1.875,2.25
MSOP10 = smd 0.3 x 1: 1 -1,-2.05; 2 -0.5,-2.05; 3 0,-2.05; 4 0.5,-2.05; 5 1,-2.05; 6 1,2.05; 7 0.5,2.05; 8 0,2.05; 9 -0.5,2.05; 10 -1,2.05
8PXMO-229 = smd 2 x 2: GND 0,0 | smd 0.813 x 0.406: P1 -3,1.895; P2 -3,0.635; P3 -3,-0.635; P4 -3,-1.895; P5 3,-1.895; P6 3,-0.635; P7 3,0.635; P8 3,1.895
TSSOP-5 = smd 0.3 x 0.5: P$1 0.15,0.25; P$2 0.8,0.25; P$3 1.45,0.25; P$4 1.45,1.9; P$5 0.15,1.9
PLCC-2 = smd 2.6 x 1.5: A 0,0.75; C 0,-2.25
SO08 = smd 0.6 x 2.2: 1 -1.905,-2.6; 2 -0.635,-2.6; 3 0.635,-2.6; 4 1.905,-2.6; 5 1.905,2.6; 6 0.635,2.6; 7 -0.635,2.6; 8 -1.905,2.6
TQFP-64 = smd 1 x 0.22: P$1 -5.5,3.5; P$2 -5.5,3; P$3 -5.5,2.5; P$4 -5.5,2; P$5 -5.5,1.5; P$6 -5.5,1; P$7 -5.5,0.5; P$8 -5.5,0; P$9 -5.5,-0.5; P$10 -5.5,-1; P$11 -5.5,-1.5; P$12 -5.5,-2; P$13 -5.5,-2.5; P$14 -5.5,-3; P$15 -5.5,-3.5; P$16 -5.5,-4; P$33 5.5,-4; P$34 5.5,-3.5; P$35 5.5,-3; P$36 5.5,-2.5; P$37 5.5,-2; P$38 5.5,-1.5; P$39 5.5,-1; P$40 5.5,-0.5; P$41 5.5,0; P$42 5.5,0.5; P$43 5.5,1; P$44 5.5,1.5; P$45 5.5,2; P$46 5.5,2.5; P$47 5.5,3; P$48 5.5,3.5 | smd 0.22 x 1: P$17 -3.75,-5.75; P$18 -3.25,-5.75; P$19 -2.75,-5.75; P$20 -2.25,-5.75; P$21 -1.75,-5.75; P$22 -1.25,-5.75; P$23 -0.75,-5.75; P$24 -0.25,-5.75; P$25 0.25,-5.75; P$26 0.75,-5.75; P$27 1.25,-5.75; P$28 1.75,-5.75; P$29 2.25,-5.75; P$30 2.75,-5.75; P$31 3.25,-5.75; P$32 3.75,-5.75; P$49 3.75,5.25; P$50 3.25,5.25; P$51 2.75,5.25; P$52 2.25,5.25; P$53 1.75,5.25; P$54 1.25,5.25; P$55 0.75,5.25; P$56 0.25,5.25; P$57 -0.25,5.25; P$58 -0.75,5.25; P$59 -1.25,5.25; P$60 -1.75,5.25; P$61 -2.25,5.25; P$62 -2.75,5.25; P$63 -3.25,5.25; P$64 -3.75,5.25

### Placement (x,y rotation side)
63001  29.46,64.26 0 top
63002  36.83,64.52 0 top
C1  59.18,73.91 90 top
C2  41.15,52.07 180 top
C3  31.24,45.21 270 top
C4  52.58,41.4 90 top
C5  49.78,33.78 0 top
C6  37.34,32.51 0 top
C7  51.82,37.85 180 top
C8  63.5,28.45 180 top
C9  68.07,28.45 0 top
C10  57.66,69.85 0 top
C11  26.67,68.83 270 top
C12  33.4,68.17 270 top
C13  50.55,64.26 90 top
C14  41.15,67.26 90 top
C15  35.81,71.12 180 top
C16  62.23,73.91 90 top
C17  57.15,76.96 0 top
C18  53.85,35.56 180 top
C19  40.64,71.12 180 top
C20  18.29,65.79 0 top
C21  8.64,72.14 180 top
C22  5.33,66.04 90 top
C23  11.18,76.96 180 top
C24  84.07,12.7 90 top
C25  100.33,66.04 0 top
C26  21.59,73.15 0 top
C27  21.84,68.58 0 top
C28  18.54,68.33 0 top
C29  18.54,62.23 90 top
HEADER1F  111.25,10.16 90 top
HEADER1M  50.29,7.87 0 top
HEADER7F  110.24,25.91 90 top
HEADER7M  7.11,10.41 90 top
HEADER9F  104.14,73.91 0 top
HEADER9M  27.94,7.87 0 top
IR1  90.42,10.16 270 top
IR6(FLASHPANEL)  107.44,63.5 0 top
L1  59.18,28.7 0 top
L2  31.24,59.18 180 top
L3  38.86,60.2 180 top
L4  6.6,75.69 0 top
LED_TEMP_1  85.34,75.18 90 top
LED_TEMP_2  85.34,65.28 90 top
MAG  53.09,72.39 0 top
R1  48.01,71.12 0 top
R2  48.01,74.93 0 top
R3  13.59,59.31 0 top
R4  22.1,62.74 0 top
R5  13.72,12.19 90 top
R6  21.59,71.37 180 top
R7  15.49,60.96 0 top
R8  21.84,65.79 180 top
R9  24.79,64.87 90 top
R10  19.56,59.18 180 top
R11  50.8,60.96 90 top
RADCONNF  7.11,42.42 90 top
SAM-ICE  73.91,48.01 270 top
U2  19.56,18.03 270 top
U$1  13.72,64.26 90 top
U$2  44.96,64.26 90 top
U$3  44.7,29.21 180 top
U$4  13.72,49.78 270 top
U$5  13.72,54.1 270 top
U$7  94.23,30.99 90 top
U$8  94.23,40.39 90 top
U$9  94.49,50.04 90 top
U$10  93.98,21.59 90 top
U$11  18.29,44.45 0 top
U$12  14.73,40.39 270 top
U$13  13.21,43.69 90 top
U$14  36.58,19.56 270 top
UC1  41.15,43.43 270 top

### Tracks (layer width: path | path; a pad name or v marks a point on that pad's centre or on a via)
3V3  (via drill 0.6, 0.76, 1.02)
  Top 0.203: C3.1 31.36,46.11 32.26,45.21 33.02,45.21 35.37,45.21 UC1.P$21 | UC1.P$56 54.36,43.18 54.36,41.4 51.05,41.4 50.92,41.26 C7.2 | UC1.P$48 49.44,37.93 49.78,37.59 49.78,34.68 C5.2 | C6.2 38.24,32.88 37.59,33.53 37.59,37.88 UC1.P$34 | U$14.3 32.64,18.92 32,19.56 29.46,19.56 27.94,18.03 U2.P$16
  Top 0.305: 33.72,21.72 U$14.1 | U$14.3 U$14.2 U$14.1 | U$14.1 33.98,22.55 38.74,27.31 U$3.P8 39.73,27.3 v39.62,25.65 | L1.1 v56.13,28.7 | v56.39,35.56 C18.1 52.97,33.78 C5.2 | R2.1 47.11,73.19 47.12,73.18 47.11,73.17 | R1.1 47.11,73.17 | MAG.4 52.08,73.14 52.07,73.15 | MAG.2 52.3,74.14 52.07,73.91 52.07,73.15 | C17.1 55.12,76.96 54.86,76.71 | C6.2 38.23,31.37 36.96,31.37 v35.31,30.73 | C7.2 51.05,37.59 49.78,37.59 | C9.2 68.97,30.34 v68.83,30.48 | v33.05,46.2 33.05,45.24 33.02,45.21 | 52.07,73.15 v51.05,73.15 | 47.11,73.17 45.99,73.17 v45.97,73.15 | MAG.13 55.34,76.24 54.86,76.71 | 54.86,76.71 54.86,76.96 v54.61,77.22 | 27,67.8 C11.2 26.67,67.82 28.45,67.82 | 63001.P$10 28.45,67.82 | v28.45,70.1 28.45,67.82
  Top 0.381: 63001.P$1 v28.46,64.5
  Route2 0.305: v56.39,35.56 58.93,35.56 | v39.62,25.65 41.4,25.15 | v33.05,46.2 33.02,46.23 | v35.31,30.73 34.8,30.23 33.27,31.75 | v68.83,30.48 67.56,31.75 | 67.56,31.75 67.82,31.75 | 67.56,31.75 67.06,31.75 66.8,31.5 | v51.05,73.15 50.55,73.15 50.29,72.9 | v45.97,73.15 45.97,73.66 45.47,74.17 | 45.47,74.17 45.47,74.42 45.72,74.68 45.72,74.42 45.47,74.17 | v54.61,77.22 54.36,77.22 54.1,77.47 | v28.46,64.5 28.21,64.5 27.43,65.28 27.43,65.02
  other vias: 17.78,71.37 29.97,75.44
  pour Route2: 1.02,80.01 80.26,80.01 80.26,1.27 1.02,1.27
3V3D
  Top 0.203: U$14.8 U$14.7 U$14.6 U$14.5 39.18,11.37 43.49,11.37 46.99,7.87 51.29,7.87 HEADER1M.P$4
  Route3 0.203: HEADER9M.P$11 25.96,4.27 27.18,4.32 50.5,4.32 HEADER1M.P$4
3V6  (via drill 0.6, 1.02)
  Top 0.305: 13.62,68.23 13.62,67.9 U$1.8
  Top 0.508: 13.62,68.23 13.72,68.33
  Top 0.762: R3.1 12.69,56.91 v12.7,56.9 | R7.1 v8.89,60.96 | U$5.P$5 v16.91,53.95 v16.92,53.95 | U$4.P$5 v17.19,49.63 v17.2,49.63 | 13.72,68.33 13.72,68.83 v14.22,69.34 | C20.1 16.17,66.97 v16,67.82
  Route2 0.305: 17.53,66.8 18.03,66.8 18.29,66.8 18.54,66.8 19.05,67.31
  Route2 0.762: v12.7,56.9 12.7,57.15 10.8,59.05 | v8.89,60.96 8.89,60.64 RADCONNF.P$8 | 11.81,60.07 16.92,54.97 v16.92,53.95 17.2,53.67 v17.2,49.63 | v14.22,69.34 15.75,69.34 18.29,66.8 | v16,67.82 17.53,67.31 18.03,66.8 | 19.56,67.82 24.38,72.64 34.54,72.64 35.05,73.15 v35.05,75.44
  Route2 2.54: RADCONNF.P$8 10.51,58.77 10.8,59.05 11.81,60.07 19.05,67.31 19.56,67.82
5V  (via drill 1.02)  (1 unrouted)
  Top 0.254: 63002.P$10 36.97,67.82 36.71,67.82
  Top 0.381: 63002.P$1 35.57,64.76 35.31,65.02 35.31,67.82 35.56,67.82 | 35.56,67.82 36.71,67.82 | 35.56,67.82 34.96,68.41 C15.2 34.96,72.22 32.51,74.68 v32.51,75.44
  Bottom 0.381: 4.57,23.87 4.57,23.62 4.57,20.32 | 4.57,23.87 4.57,60.2 6.86,62.48 6.86,65.02 9.91,68.07 14.48,68.07 16.51,70.1 16.51,72.39 17.27,73.15 30.99,73.15 32.51,74.68 v32.51,75.44 | 4.57,9.14 4.57,4.06 24.13,4.06 HEADER9M.P$10 | 4.57,9.14 4.57,18.29 | 4.57,18.29 4.57,20.32 | 4.57,23.97 4.57,23.87 | 7.02,20.41 4.67,20.41 4.57,20.32 | HEADER7M.P$5 4.7,18.41 4.57,18.29 | HEADER7M.P$7 HEADER7M.P$8 9.11,10.38 7.62,8.89 4.83,8.89 4.57,9.14
CHARGE  (via drill 1.02)
  Top 0.203: R11.2 50.15,61.86 48.26,63.75 U$2.2 45.97,63.76 45.72,64.01 45.72,71.63 40.39,75.18
  Top 0.254: v37.59,75.44 37.85,75.18 40.39,75.18
GND  (via drill 0.6, 0.76, 1.02)
  Top 0.203: C19.2 38.1,71.12 | U$11.C 16.8,43.69 U$13.C
  Top 0.254: 30.11,66.16 63001.P$9 v30.11,70.21 v30.1,70.21 | 37.47,66.93 63002.P$9 37.46,69.47 | 15.75,11.76 17.47,13.48 U2.P$8 | U$13.C 13.97,45.18 v13.97,47.24
  Top 0.305: C1.2 57.67,74.81 v57.45,74.5 56.99,74.14 MAG.11 | MAG.9 56.4,73.14 v56.9,72.64 | UC1.P$7 41.65,50.28 41.66,50.29 41.66,51.68 C2.1 42.05,54.22 v42.04,54.23 | C18.2 52.95,38.12 C7.1 52.69,39 v52.65,39.29 C4.1 | C5.1 v47.5,33.27 47.7,33.48 U$3.P4 | UC1.P$47 44.15,39.58 v44.2,39.62 | UC1.P$54 45.23,42.18 v44.96,42.16 | UC1.P$33 37.15,34.76 v36.42,34.04 36.44,34.02 C6.1 | U$4.P$3 13.97,47.76 v13.97,47.24 | U$5.P$3 v13.97,51.57 v13.97,51.56 | C9.1 v65.79,28.45 C8.1 | 15.75,11.76 v15.75,11.43 15.61,11.29 R5.1 | C20.2 19.56,65.28 v19.56,64.26 | v38.1,72.39 38.1,71.12 | C23.1 12.03,69.94 v11.68,69.6 | C12.2 32.27,67.32 31.24,66.29 30.75,66.29 63001.PAD | C14.1 41.03,66.41 39.88,67.56 39.62,67.56 38.61,66.55 38.12,66.55 63002.PAD | C11.1 26.76,69.68 28.45,71.37 29.72,71.37 29.72,70.59 v30.1,70.21
  Top 0.381: U$12.C v12.45,36.32 | R6.1 C26.2 24.52,75.18 v24.89,75.44 | 22.49,68.83 C27.2 v23.88,68.58 | v11.68,69.6 11.68,66.17 U$1.17 | R8.1 24.78,65.79 R9.2 24.89,65.77 v24.89,66.8 | 30.11,66.16 63001.PAD 30.61,66.16 63001.P$3 | C15.1 38.1,71.12 38.1,70.1 37.46,69.47 | 37.47,66.93 63002.PAD 37.98,64.77 63002.P$3 | U$2.7 41.66,64.76 v41.15,64.77 | C16.2 C1.2 59.18,75.83 C17.2
  Top 0.508: U$3.GND v44.7,27.18
  Route2 0.762: v12.45,36.32 v19.05,34.54
  Route3 0.305: v56.9,72.64 56.9,74.04 v57.45,74.5 | v47.5,33.27 47.75,34.8 | v44.2,39.62 44.7,39.37 | 52.32,39.37 v52.65,39.29 | 47.5,34.04 v47.5,33.27 | v13.97,47.24 13.97,47.3 | 48.26,33.78 v47.5,33.27 | HEADER9M.P$12 21.57,4.59
  Route3 0.381: v19.56,64.26 18.03,66.04 18.29,66.29 18.29,66.55 | v24.89,66.8 23.88,66.8 | v57.45,74.5 57.66,76.96
  Route3 0.406: 41.4,65.02 v41.15,64.77
  Route3 0.508: v44.7,27.18 44.7,24.64
  Bottom 0.305: v26.16,71.37 v33.27,71.37
  pour Route3: 1.02,79.25 80.01,79.25 80.01,3.05 80.01,1.27 0.76,1.27 0.76,79.5 1.02,79.5
H1.1  (via drill 1.02)
  Top 0.305: v104.14,5.33 107.43,5.33 HEADER1F.P$1
H1.2  (via drill 1.02)
  Top 0.305: IR1.SCL 95.5,7.87 98.04,10.41 v104.14,10.41 110,10.41 HEADER1F.P$2
H1.3  (via drill 1.02)
  Top 0.305: IR1.SDA 95.51,12.95 v104.14,12.95 109.46,12.95 HEADER1F.P$3
H1.4  (via drill 1.02)
  Top 0.305: C24.2 89.28,13.6 IR1.VDD 93.47,15.49 v104.14,15.49 109.22,15.49 112.25,12.46 HEADER1F.P$4
H1.5  (via drill 1.02)
  Top 0.305: IR1.VSS 87.88,10.41 84.84,10.41 C24.1
  Bottom 0.305: IR1.VSS 89.15,9.14 102.87,9.14 v104.14,7.87 105.92,7.87 107.19,9.14 112.27,9.14 112.25,9.16 HEADER1F.P$5
H7.1  (via drill 1.02)  (1 unrouted)
  Top 0.305: HEADER7F.P$1 107.44,25.91 v106.43,26.92 101.73,22.22
H7.2  (via drill 1.02)  (1 unrouted)
  Top 0.305: HEADER7F.P$2 107.98,27.91 v106.43,29.46 107.7,29.46 108.71,29.97 108.71,45.21 102.36,50.8 97.22,50.8
H7.3  (via drill 1.02)  (1 unrouted)
  Top 0.305: v101.09,41.15 96.96,41.15
  Bottom 0.305: HEADER7F.P$3 108.52,29.91 v106.43,32 104.14,32 99.82,36.32 99.82,39.88 v101.09,41.15
H7.4  (via drill 1.02)  (1 unrouted)
  Top 0.305: v102.62,37.34 102.62,35.56 98.81,31.75 96.96,31.75
  Bottom 0.305: HEADER7F.P$4 109.06,31.91 v106.43,34.54 105.41,34.54 v102.62,37.34
H7.5  (via drill 1.02)
  Top 0.305: v106.43,37.08 105.41,37.08 98.55,30.23 96.96,30.23 U$7.2
  Bottom 0.305: HEADER7F.P$5 109.6,33.91 v106.43,37.08
H7.6  (via drill 1.02)
  Top 0.305: U$8.2 106.3,39.75 v106.43,39.62 106.52,39.62
  Bottom 0.305: HEADER7F.P$6 110.14,35.91 v106.43,39.62
H7.7  (via drill 1.02)
  Top 0.305: v106.43,21.84 108.17,21.84 HEADER7F.P$7 | v106.43,42.42 102.62,48.26 101.6,49.28 97.22,49.28 U$9.2
  Bottom 0.305: HEADER7F.P$7 112.24,25.94 111.25,26.92 111.25,36.32 v106.43,42.42
H7.8  (via drill 1.02)
  Top 0.305: v106.43,24.38 103,20.95 U$10.2
  Bottom 0.305: HEADER7F.P$8 112.24,27.72 114.55,25.4 114.55,24.38 114.3,24.13 106.68,24.13 v106.43,24.38
H7.9  (via drill 1.02)
  Top 0.305: v115.32,28.45 113.7,28.45 HEADER7F.P$9
H7.10  (via drill 1.02)
  Top 0.305: v115.32,30.99 113.16,30.99 HEADER7F.P$10
H7.11  (via drill 1.02)
  Top 0.305: v115.32,33.53 112.62,33.53 HEADER7F.P$11
H7.12  (via drill 1.02)
  Top 0.305: v115.32,36.07 112.4,36.07 HEADER7F.P$12
H7.13  (via drill 2.54)
  Top 0.762: HEADER7F.P$13 112.81,39.91 114.3,41.4 114.3,50.8 v113.28,54.1
H7.14  (via drill 2.54)
  Top 0.762: HEADER7F.P$14 111.24,47.01 v107.19,54.1
H9.1  (via drill 1.02)
  Top 0.254: HEADER9F.P$1 99.14,75.1 98.65,75.82 LED_TEMP_1.3
  Top 0.305: 98.65,75.82 98.65,77.57 v99.06,77.98
H9.2  (via drill 1.02)
  Top 0.254: HEADER9F.P$2 101.08,74.91 100.08,73.91 98.55,73.91 90.53,65.89 89.01,65.89 LED_TEMP_2.3
  Top 0.305: HEADER9F.P$2 101.14,77.52 v101.6,77.98
H9.3  (via drill 1.02)
  Top 0.305: HEADER9F.P$3 103.14,76.98 v104.14,77.98
H9.4  (via drill 1.02)
  Top 0.305: HEADER9F.P$4 105.14,76.44 v106.68,77.98
H9.5  (via drill 1.02)
  Top 0.305: HEADER9F.P$5 107.14,75.9 v109.22,77.98
H9.6  (via drill 1.02)
  Top 0.305: HEADER9F.P$6 109.14,75.36 v111.76,77.98
H9.7  (via drill 1.02)
  Top 0.305: HEADER9F.P$7 111.76,70.29 v111.76,70.1
H9.8  (via drill 1.02)
  Top 0.305: HEADER9F.P$8 107.14,72.18 v109.22,70.1 109.22,64.02 IR6(FLASHPANEL).SCL
H9.9  (via drill 1.02)
  Top 0.305: HEADER9F.P$9 105.14,71.64 v106.68,70.1 107.44,69.34 IR6(FLASHPANEL).SDA
H9.10  (via drill 0.6, 1.02)
  Top 0.254: LED_TEMP_2.2 90.81,64.64 v96.27,70.1 | LED_TEMP_1.2 90.3,74.55 v91.03,74.52
  Top 0.305: HEADER9F.P$10 103.14,71.1 v104.14,70.1
  Bottom 0.254: v91.03,74.52 v96.27,70.1
  Bottom 0.305: v96.27,70.1 97.79,71.63 103.14,71.63 HEADER9F.P$10
H9.11  (via drill 1.02)
  Top 0.305: HEADER9F.P$11 101.14,70.56 v101.6,70.1 101.6,66.41 C25.2 102.61,66.04 IR6(FLASHPANEL).VDD
H9.12  (via drill 1.02)
  Top 0.254: 99.43,72.62 HEADER9F.P$12
  Top 0.305: 99.43,72.62 99.43,70.47 v99.06,70.1 99.06,66.41 C25.1 99.43,64.15 102.37,61.21 IR6(FLASHPANEL).VSS
N$1
  Top 0.203: C1.1 58.3,73.01 57.66,73.66 55.88,73.66 MAG.10
N$3  (via drill 0.6)
  Top 0.203: C21.1 9.49,71.54 v10.41,70.61 | v6.35,68.83 6.35,67.51 6.88,66.88 9.73,66.88 U$1.11
  Bottom 0.203: v10.41,70.61 8.13,70.61 v6.35,68.83
N$4
  Top 0.203: C22.1 5.53,65.39 U$1.14
N$5  (via drill 0.6)
  Top 0.203: U$1.15 9.7,64.9 7.11,64.9 7.11,63.75 v5.08,63.75 | v10.41,75.44 10.41,76.87 C23.2
  Bottom 0.203: v5.08,63.75 5.08,69.6 v10.41,75.44
N$16
  Top 0.203: U$3.P1 47.36,27.31 46.48,28.19 46.48,30.99 46.23,31.24 43.94,31.24 41.15,34.04 UC1.P$41
N$18
  Top 0.203: U$3.P2 47.62,28.57 46.99,29.21 46.99,32 43.94,32 41.66,34.29 UC1.P$42
N$19  (via drill 0.6)
  Top 0.203: U$3.P3 49.15,29.84 v49.28,29.97 | v39.12,39.88 39.12,37.97 UC1.P$37
  Bottom 0.203: 49.02,29.97 v49.28,29.97 46.48,32.77 46.48,34.8 45.72,35.56 44.7,35.56 43.94,36.32 43.94,37.08 43.69,37.34 43.69,38.1 41.91,39.88 v39.12,39.88
N$20
  Top 0.203: HEADER9M.P$1 26.67,12.6 26.67,13.46 26,14.13 U2.P$10
N$21
  Top 0.203: HEADER9M.P$2 27.18,11.11 27.18,13.97 26.36,14.78 U2.P$11
N$22
  Top 0.203: HEADER9M.P$3 27.69,9.62 27.69,14.73 26.98,15.43 U2.P$12
N$23
  Top 0.203: HEADER9M.P$4 28.45,9.37 28.45,15.24 27.6,16.08 U2.P$13
N$24
  Top 0.203: U2.P$6 13.77,14.78 10.41,11.43 8.13,11.43 HEADER7M.P$1
N$25
  Top 0.203: HEADER7M.P$2 7.33,12.41 8.38,13.46 10.92,13.46 12.85,15.39 19.52,15.39 U2.P$5
N$26
  Top 0.203: HEADER7M.P$3 7.11,14.73 7.87,15.49 11.43,15.49 11.94,16 19.48,16 U2.P$4
N$27
  Top 0.203: U2.P$3 19.53,16.76 10.92,16.76 10.16,17.53 8.22,17.53 HEADER7M.P$4
N$28  (via drill 0.6)
  Top 0.203: UC1.P$30 30.78,40.68 30.73,40.64 v30.73,37.85 | U2.P$14 28.42,16.73 v29.97,18.29
  Bottom 0.203: v30.73,37.85 30.73,19.05 v29.97,18.29
N$29
  Top 0.203: UC1.P$31 32.49,40.18 32.49,37.06 18.29,22.86 18.29,18.03 18.94,17.38 U2.P$2
N$30
  Top 0.203: UC1.P$43 42.16,37.95 42.16,41.91 39.12,41.91 34.04,36.83 33.27,36.83 33.27,36.58 20.07,23.37 20.07,18.54 U2.P$1
N$31  (via drill 0.6)
  Top 0.203: v28.7,20.32 25.91,20.32 24.13,18.54 24.13,17.78 24.56,17.35 U2.P$15 | v43.18,35.05 43.18,35.31 42.67,35.81 42.67,37.91 UC1.P$44
  Route3 0.203: v28.7,20.32 33.27,24.89 33.27,29.21 35.31,29.21 40.13,34.04 42.16,34.04 v43.18,35.05
N$34
  Top 0.203: U$3.P7 41.53,28.57 39.62,30.48 39.62,37.91 UC1.P$38
N$35
  Top 0.203: U$3.P6 41.78,29.84 42.42,30.48 42.42,31.75 40.64,33.53 UC1.P$40
N$36
  Top 0.203: C10.1 55.37,69.85 55.37,72.58 MAG.8
N$38
  Top 0.203: UC1.P$58 46.41,44.2 64.26,44.2 71.88,51.82 SAM-ICE.7
N$39
  Top 0.203: UC1.P$57 65.53,43.69 71.12,49.28 SAM-ICE.9
N$40
  Top 0.203: L4.1 5.33,75.56 C22.2 5.84,66.39 U$1.12 U$1.13
N$41
  Top 0.203: C3.2 31.87,44.31 32.26,44.7 35.38,44.7 UC1.P$22
N$42
  Top 0.203: U$3.P5 41.03,31.11 40.13,32 40.13,37.92 UC1.P$39
N$43  (via drill 0.6)
  Top 0.203: C2.2 41.15,51.17 UC1.P$8 v41.15,47.24 | v59.94,31.5 59.94,28.89 L1.2 60.39,28.45 C8.2
  Route2 0.203: 59.94,43.94 v59.94,31.5
  Route2 0.305: v41.15,47.24 42.42,44.2 59.94,43.94
N$45
  Top 0.203: 63002.P$2 37.46,60.88 L3.2
N$46
  Top 0.203: L3.1 38.35,62.11 38.35,62.23 38.1,62.48 38.1,64.01 38.47,64.63 63002.P$4
N$47
  Top 0.203: UC1.P$55 46.5,42.68 C4.2
N$48
  Top 0.203: 63001.P$2 30.15,64.46 30.15,59.64 29.84,59.33 L2.2
N$50
  Top 0.203: L2.1 31.1,60.72 63001.P$4
N$53
  Top 0.203: L4.2 7.79,75.47 C21.2 7.79,67.91 7.87,67.82 9.75,67.82 U$1.9 U$1.10
N$54
  Top 0.203: C28.2 19.44,67.43 20.07,66.8 20.07,65.28 21.2,64.15 R4.1 | 14.62,59.18 R3.2 | R10.2 18.8,59.04 | 21.08,57.91 21.2,58.05
  Top 0.254: U$1.2 14.22,64.89 14.22,64.77
  Top 0.305: 14.22,64.77 15.49,64.77 15.49,59.18
  Top 0.381: R10.2 15.49,59.18 14.62,59.18 | 18.8,59.04 18.8,57.91 21.08,57.91 | 21.2,58.05 R4.1
N$57
  Top 0.203: U$2.3 49.65,64.26 C13.1
N$58
  Top 0.203: C13.2 49.92,65.16 49.53,64.77 U$2.4
N$69  (via drill 0.6)
  Top 0.203: C26.1 R6.2 v19.3,71.37 | 16.39,65.41 16.28,65.41 16.28,65.39 | 16.76,60.96 R7.2
  Top 0.381: R7.2 16.39,65.41 | 16.28,65.39 U$1.3 | v17.53,60.2 16.76,60.96
  Bottom 0.203: v19.3,71.37 18.29,70.36 18.29,60.45 18.03,60.2 v17.53,60.2
N$70
  Top 0.203: C29.1 20.2,61.33 20.57,60.96 20.57,59.3 R10.1
N$71  (via drill 0.6)
  Top 0.203: C29.2 18.17,63.13 v17.27,62.23 | v11.18,62.99 12.95,62.99 13.72,63.75 13.72,64.29 U$1.1 | C28.1 17.64,69.46 v17.53,69.6
  Bottom 0.203: v11.18,62.99 11.18,62.74 11.68,62.23 v17.27,62.23 17.27,69.09 v17.53,69.6
N$72  (via drill 0.6)
  Top 0.203: v37.59,28.7 37.59,29.46 39.12,30.99 39.12,34.04 38.65,34.5 UC1.P$36 | v37.08,14.99 34.42,17.65 U$14.4
  Bottom 0.203: v37.59,28.7 37.08,28.19 v37.08,14.99
N$999
  Top 0.203: R4.2 23.56,62.74 R9.1
PA00  (via drill 0.6)
  Top 0.203: UC1.P$1 44.65,70.67 v44.2,71.12 | v52.83,76.96 54.34,75.97 MAG.15
  Bottom 0.203: v44.2,71.12 44.2,75.18 47.24,77.47 v52.83,76.96
PA01
  Top 0.203: UC1.P$2 44.15,62.02 U$2.10
PA02  (via drill 1.02)
  Top 0.203: UC1.P$3 43.65,47.54 43.69,47.5 45.21,47.5 45.21,47.75 45.47,48.01 45.47,52.58 45.97,53.09 48.26,53.09 49.02,52.32 52.83,52.32 v54.36,53.85
PA03  (via drill 0.51, 1.02)
  Top 0.203: UC1.P$4 43.15,49.5 43.43,49.78 43.43,52.88 v43.23,53.09
  Bottom 0.203: v43.23,53.09 48.26,53.09 49.02,53.85 v51.82,53.85
PA04  (via drill 0.6, 1.02)
  Top 0.203: MAG.16 53.85,75.18 53.85,75.69 52.58,75.69 52.32,75.44 50.55,75.44 50.04,74.93 R2.2 48.91,76.32 v48.77,76.45 | v38.61,50.55 38.61,48.97 UC1.P$13
  Bottom 0.203: v48.77,76.45 48.77,67.31 | 48.77,67.31 48.77,66.8 38.35,56.39 38.35,50.8 v38.61,50.55 | v59.44,55.88 59.44,60.71 52.83,67.31 48.77,67.31
PA05  (via drill 0.6, 1.02)
  Top 0.203: MAG.1 53.27,74.68 50.55,74.68 48.91,73.04 R1.2 50.68,69.34 v51.05,69.34 56.9,63.5 v56.9,55.88 | v36.32,52.58 36.32,51.82 37.59,50.55 37.59,50.04 38.15,49.48 UC1.P$14
  Route3 0.203: v51.05,69.34 49.02,67.31 49.02,59.94 45.21,56.13 36.32,56.13 v36.32,52.58
PA06  (via drill 1.02)
  Top 0.203: v20.83,45.47 24.64,45.47
  Top 0.305: HEADER7M.P$13 HEADER7M.P$14 10.89,31.97 24.38,45.47 24.64,45.47 28.96,45.47 28.96,45.72 30.99,47.75 36.83,47.75 37.34,47.24 37.85,47.24 37.85,47.83 37.67,48.01 37.67,48.91 UC1.P$15
PA07  (via drill 1.02)
  Top 0.203: UC1.P$16 32.85,48.93 30.23,51.56 26.42,51.56 v24.13,53.85
PA12  (via drill 0.6)
  Top 0.203: U$2.5 48.04,66.29 51.82,66.29 52.83,65.28 52.83,59.44 51.31,57.91 v49.53,57.91 | v24.89,41.15 24.93,41.18 UC1.P$29
  Route2 0.203: v49.53,57.91 34.29,57.91 24.89,48.51 v24.89,41.15
PA15  (via drill 0.6)
  Top 0.203: UC1.P$32 35.37,39.68 v34.04,38.35
  Bottom 0.203: v34.04,38.35 34.04,36.83 31.5,34.29 31.5,13.27 32.94,11.83 HEADER9M.P$6
PA16  (via drill 0.6)
  Top 0.203: v29.21,30.99 29.21,31.24 37.85,39.88 38.15,39.58 UC1.P$35
  Bottom 0.203: v29.21,30.99 27.18,28.96 27.18,18.03 30.73,14.48 30.73,9.08 HEADER9M.P$5
PA24  (via drill 0.6)
  Top 0.203: U$4.P$2 14.82,48.98 14.96,48.84 29.26,48.84 v29.29,48.82 | v45.21,36.58 43.18,36.58 43.18,37.9 UC1.P$45
  Route2 0.203: v29.29,48.82 32.72,48.82 39.62,41.91 39.62,41.66 v45.21,36.58
PA25  (via drill 0.6)
  Top 0.203: U$5.P$4 15.64,52.63 v18.72,52.63 | v43.43,40.89 43.43,40.39 43.18,40.13 43.18,39.12 43.69,38.61 43.69,37.97 UC1.P$46
  Route3 0.203: v18.72,52.63 18.77,52.58 31.75,52.58 v43.43,40.89
PB00  (via drill 0.6, 1.02)
  Top 0.203: R5.2 14.76,14.13 U2.P$7 22.19,14.13 22.35,13.97 | 22.35,13.97 22.35,13.46 24.23,13.46 U2.P$9 | UC1.P$61 51.53,45.68 v51.56,45.72 | v22.35,16.26 22.35,13.97
  Top 0.254: v51.56,45.72 54.1,45.72 v59.44,51.05
  Route3 0.203: v53.59,16.51 24.89,16.51 v22.35,16.26
  Bottom 0.203: v51.56,45.72 50.8,45.72 48.26,43.18 48.26,37.85 53.34,32.77 v53.59,16.51
PB01  (via drill 0.6, 1.02)
  Top 0.203: v44.2,46.23 46.35,46.23 UC1.P$62
  Route3 0.203: RADCONNF.P$3 8.13,45.46 10.16,45.47 14.22,49.78 15.75,51.31 15.75,55.88 16,56.13 29.97,56.13 40.39,45.72 43.69,45.72 v44.2,46.23
  Route3 0.254: v56.9,51.05 56.9,50.29 53.85,47.24 51.31,47.24 49.28,45.21 45.21,45.21 v44.2,46.23
PB02  (via drill 0.6, 1.02)
  Top 0.203: U$4.P$1 13.97,50.29 14.22,50.55 v29.21,50.55 | v49.02,46.74 46.45,46.74 UC1.P$63
  Route2 0.203: v29.21,50.55 34.04,50.55 35.56,49.02 47.24,49.02 49.02,47.24 v49.02,46.74
  Route2 0.254: v54.36,51.05 54.36,50.29 53.34,46.74 v49.02,46.74
PB03  (via drill 0.6, 1.02)
  Top 0.203: U$5.P$1 13.97,55.12 14.22,55.37 v33.53,55.37 | v46.48,51.82 46.4,51.73 UC1.P$64
  Top 0.305: v46.48,51.82 51.05,51.82 v51.82,51.05
  Route2 0.203: v33.53,55.37 34.04,54.86 37.59,54.86 40.64,51.82 v46.48,51.82
PB04  (via drill 0.51, 0.6, 1.02)
  Top 0.203: UC1.P$5 42.65,47.27 v42.67,47.24
  Top 0.254: v42.67,47.24 42.67,44.96 v43.18,44.96
  Route3 0.254: v61.98,55.88 63.25,56.13 64.52,54.86 64.52,49.02 63.75,48.26 58.17,48.26 54.36,43.69 v43.18,44.96
  Bottom 0.203: v42.67,47.24 46.23,47.24 46.74,46.74 46.74,36.83 51.82,31.75 51.82,9.35 HEADER1M.P$3 52.85,8.87 54.1,7.62 54.1,5.33 53.34,4.57 31.24,4.57 HEADER9M.P$9
PB05  (via drill 0.6)
  Top 0.203: HEADER1M.P$2 50.29,31.5 v50.04,31.75 | v42.67,50.55 42.16,50.04 42.16,48.95 UC1.P$6
  Bottom 0.203: HEADER9M.P$8 30.94,6.4 32,5.33 49.02,5.33 49.28,5.59 49.28,7.86 HEADER1M.P$2 | v50.04,31.75 50.04,32.26 46.23,36.07 46.23,38.61 45.97,38.86 45.97,43.18 45.21,43.94 42.42,43.94 42.16,44.2 42.16,44.45 40.13,46.48 40.13,49.53 40.64,50.04 42.16,50.04 v42.67,50.55
PB06  (via drill 0.51, 1.02)
  Top 0.203: UC1.P$9 40.65,48.27 40.13,47.75 40.13,45.21 42.67,42.67 43.18,42.67 v43.43,42.93
  Route3 0.203: v43.43,42.93 42.16,42.93 32,53.09 32,53.34 29.72,55.63 28.45,55.63 v26.67,53.85
PB07  (via drill 1.02)
  Top 0.203: U$1.7 14.05,67.39 16.26,70.36 19.93,70.36 C27.1 R8.2 21.08,65.79 22.1,64.77 25.91,64.77 27.94,62.74 27.94,58.67 | 27.94,58.67 27.94,57.4 28.96,56.39 34.31,56.36 40.13,50.55 40.13,48.95 UC1.P$10 | v25.91,58.67 27.94,58.67
PB08  (via drill 0.6, 1.02)
  Top 0.203: UC1.P$11 39.65,43.41 v39.88,43.18
  Route3 0.203: v39.88,43.18 39.88,42.93 37.34,40.39 18.8,39.88 11.68,32.77 11.68,32.51 11.43,32.26 11.43,27.94 | 11.43,27.94 11.43,17.27 HEADER7M.P$9 | v13.46,27.94 11.43,27.94
PB09  (via drill 0.6, 1.02)
  Top 0.203: UC1.P$12 39.15,47.78 v38.61,44.45
  Bottom 0.203: v39.88,54.86 39.88,53.34 39.37,52.83 39.37,45.21 v38.61,44.45 38.61,41.4 36.58,39.37 19.56,39.37 15.24,35.05 15.24,21.84 9.81,16.41 HEADER7M.P$10
PB15  (via drill 0.6)
  Top 0.203: U$2.6 42.67,65.5 v42.67,66.55 | v37.34,41.66 35.43,41.66 UC1.P$28
  Bottom 0.203: v42.67,66.55 42.67,61.21 41.91,61.21 37.59,56.9 37.59,41.91 v37.34,41.66
PWR_OUT_SIDE1  (via drill 1.02)
  Top 0.305: v104.14,2.79 106.89,2.79 HEADER1F.P$6
R2
  Top 0.203: U$13.A 11.73,44.42 RADCONNF.P$4
R3  (via drill 0.6)
  Top 0.203: v15.75,46.23 15.75,48.2 U$4.P$4
  Bottom 0.203: v15.75,46.23 12.45,46.23 11.18,47.5 8.13,47.5 7.11,46.48 RADCONNF.P$5
R4
  Top 0.203: U$12.A 14.47,41.4 13.97,41.4 13.72,41.66 13.72,44.7 13.21,45.47 12.95,45.72 9.81,45.72 RADCONNF.P$6
R12  (via drill 0.6)
  Top 0.203: U$11.A v18.29,43.69
  Bottom 0.203: v18.29,43.69 15.75,41.15 7.11,41.15 RADCONNF.P$1
R14
  Top 0.203: U$5.P$2 11.9,53.3 10.16,51.56 10.16,47.75 8.38,47.75 8.13,47.5 8.13,43.4 RADCONNF.P$2
RESETN  (via drill 0.6)
  Top 0.203: UC1.P$52 46.43,41.15 48.51,41.15 v49.53,41.66
  Bottom 0.203: v49.53,41.66 SAM-ICE.15
SETC  (via drill 0.6)
  Top 0.203: C10.2 58.56,71.49 v58.42,71.63 | v56.39,75.69 56.39,74.63 MAG.12
  Bottom 0.203: v58.42,71.63 58.42,75.69 v56.39,75.69
VIN  (via drill 0.6, 1.02)  (1 unrouted)
  Top 0.279: U$1.5 U$1.4
  Top 0.305: 63001.P$8 63001.P$7 63001.P$6 31.5,67.93 v31.5,68.83 31.69,69.02 C12.1 | 63001.P$5 31.61,64.52 v32.51,64.52 | 63002.P$8 63002.P$7 63002.P$6 39.12,68.22 v39.12,69.09 41.15,69.09 | C19.1 41.4,71.03 41.4,69.09 41.15,69.09 | 63002.P$5 39.12,64.61 v39.12,63.75 41.66,63.75 42.16,64.26 U$2.8 | U$2.1 47.24,63.03 v47.24,60.2 50.66,60.2 R11.1 | C16.1 v62.23,71.12 | C14.2 41.15,69.09 | U$1.6 U$1.5 | 9.32,64.39 U$1.16
  Top 0.508: v14.73,66.29 14.73,66.39 U$1.5 | v8.38,64.01 9.14,64.26
  Route3 0.305: v31.5,68.83 31.75,69.09 31.75,72.9 27.43,72.9 | v31.5,68.83 31.5,65.53 v32.51,64.52 38.35,64.52 v39.12,63.75 43.69,63.75 v47.24,60.2 | v39.12,69.09 38.86,68.83 v31.5,68.83 | v62.23,71.12 60.71,72.64 60.71,77.98 60.2,77.98 27.43,77.72
  Route3 0.381: 27.43,72.9 v27.43,75.44
  Route3 1.27: v27.43,75.44 27.43,77.72 18.8,77.72 17.53,76.45 17.53,74.68 16.76,73.91 9.14,73.91 8.38,73.15 8.38,67.31 | v8.38,64.01 8.38,67.31 | v14.73,66.29 13.72,67.31 8.38,67.31

### Text on the board
tPlace: LTC3112
tNames: GND | VIN | 3V3 | 5V | 3V6 | CHARGE | U2: Bus Switch
Document: PB07 | PA05 | PA04 | PB04 | PB09 | PA03 | PA02 | PA07 | PB06 | PB03 | PB02 | PB01 | PB00 | PB05 | PA06 | PB08 | Ryan Izant | September 2015: V1.1 | Brown University CubeSat Team | EquiSat Engineering Model Control Board
Reference: H9.1 | H9.2 | H9.3 | H9.4 | H9.5 | H9.6 | H9.12 | H9.11 | H9.10 | H9.9 | H9.8 | H9.7
tDocu: H7.14 | H7.13 | H7.6 | H7.5 | H7.12 | H7.4 | H7.11 | H7.3 | H7.2 | H7.10 | H7.1 | H7.9 | H7.8 | H7.7 | H1.4 | H1.3 | H1.2 | H1.5 | H1.1 | H1.6